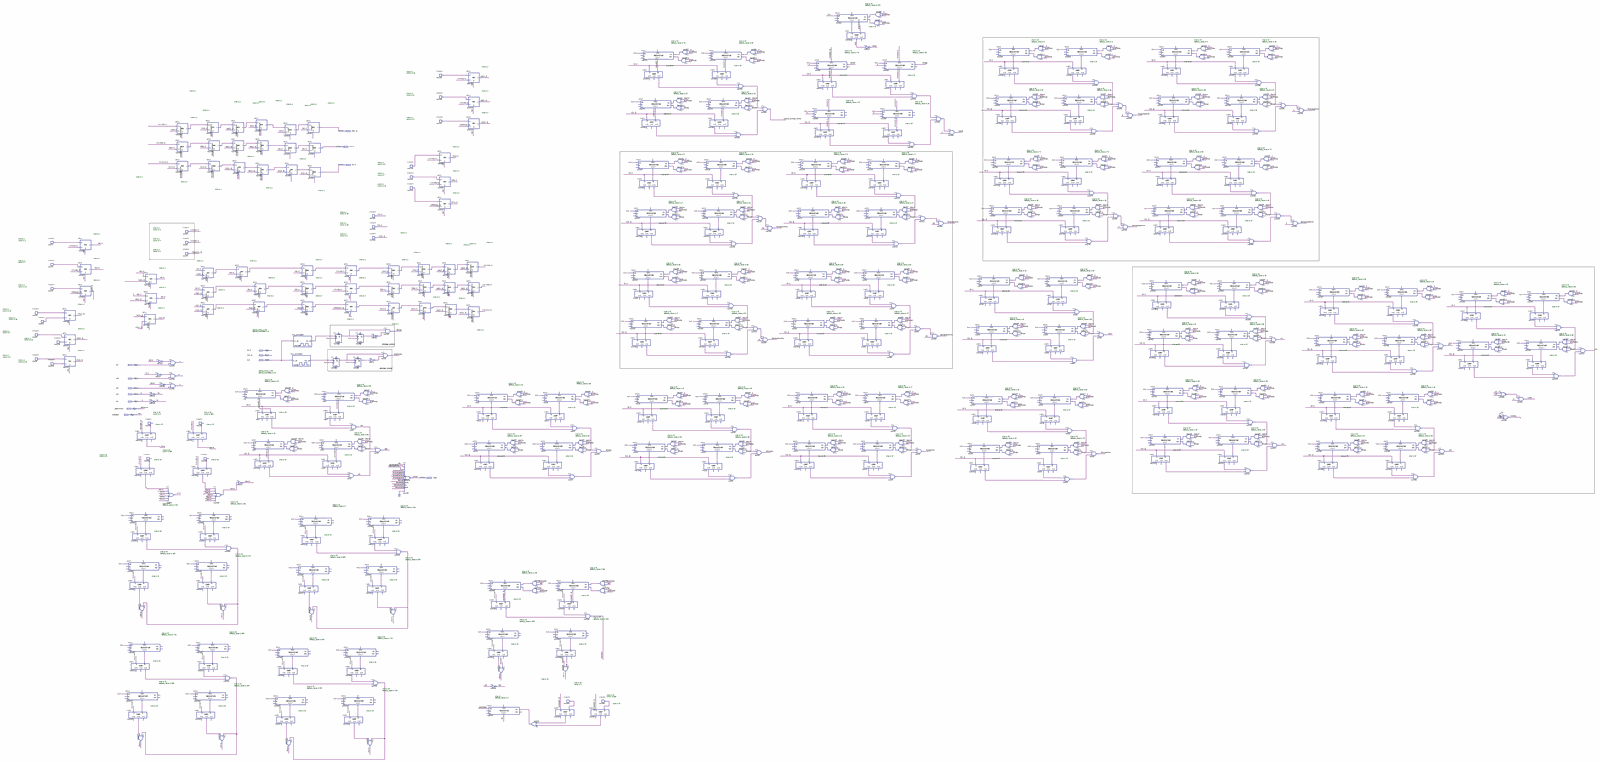
[diagram p0: schematic sheet, whole]
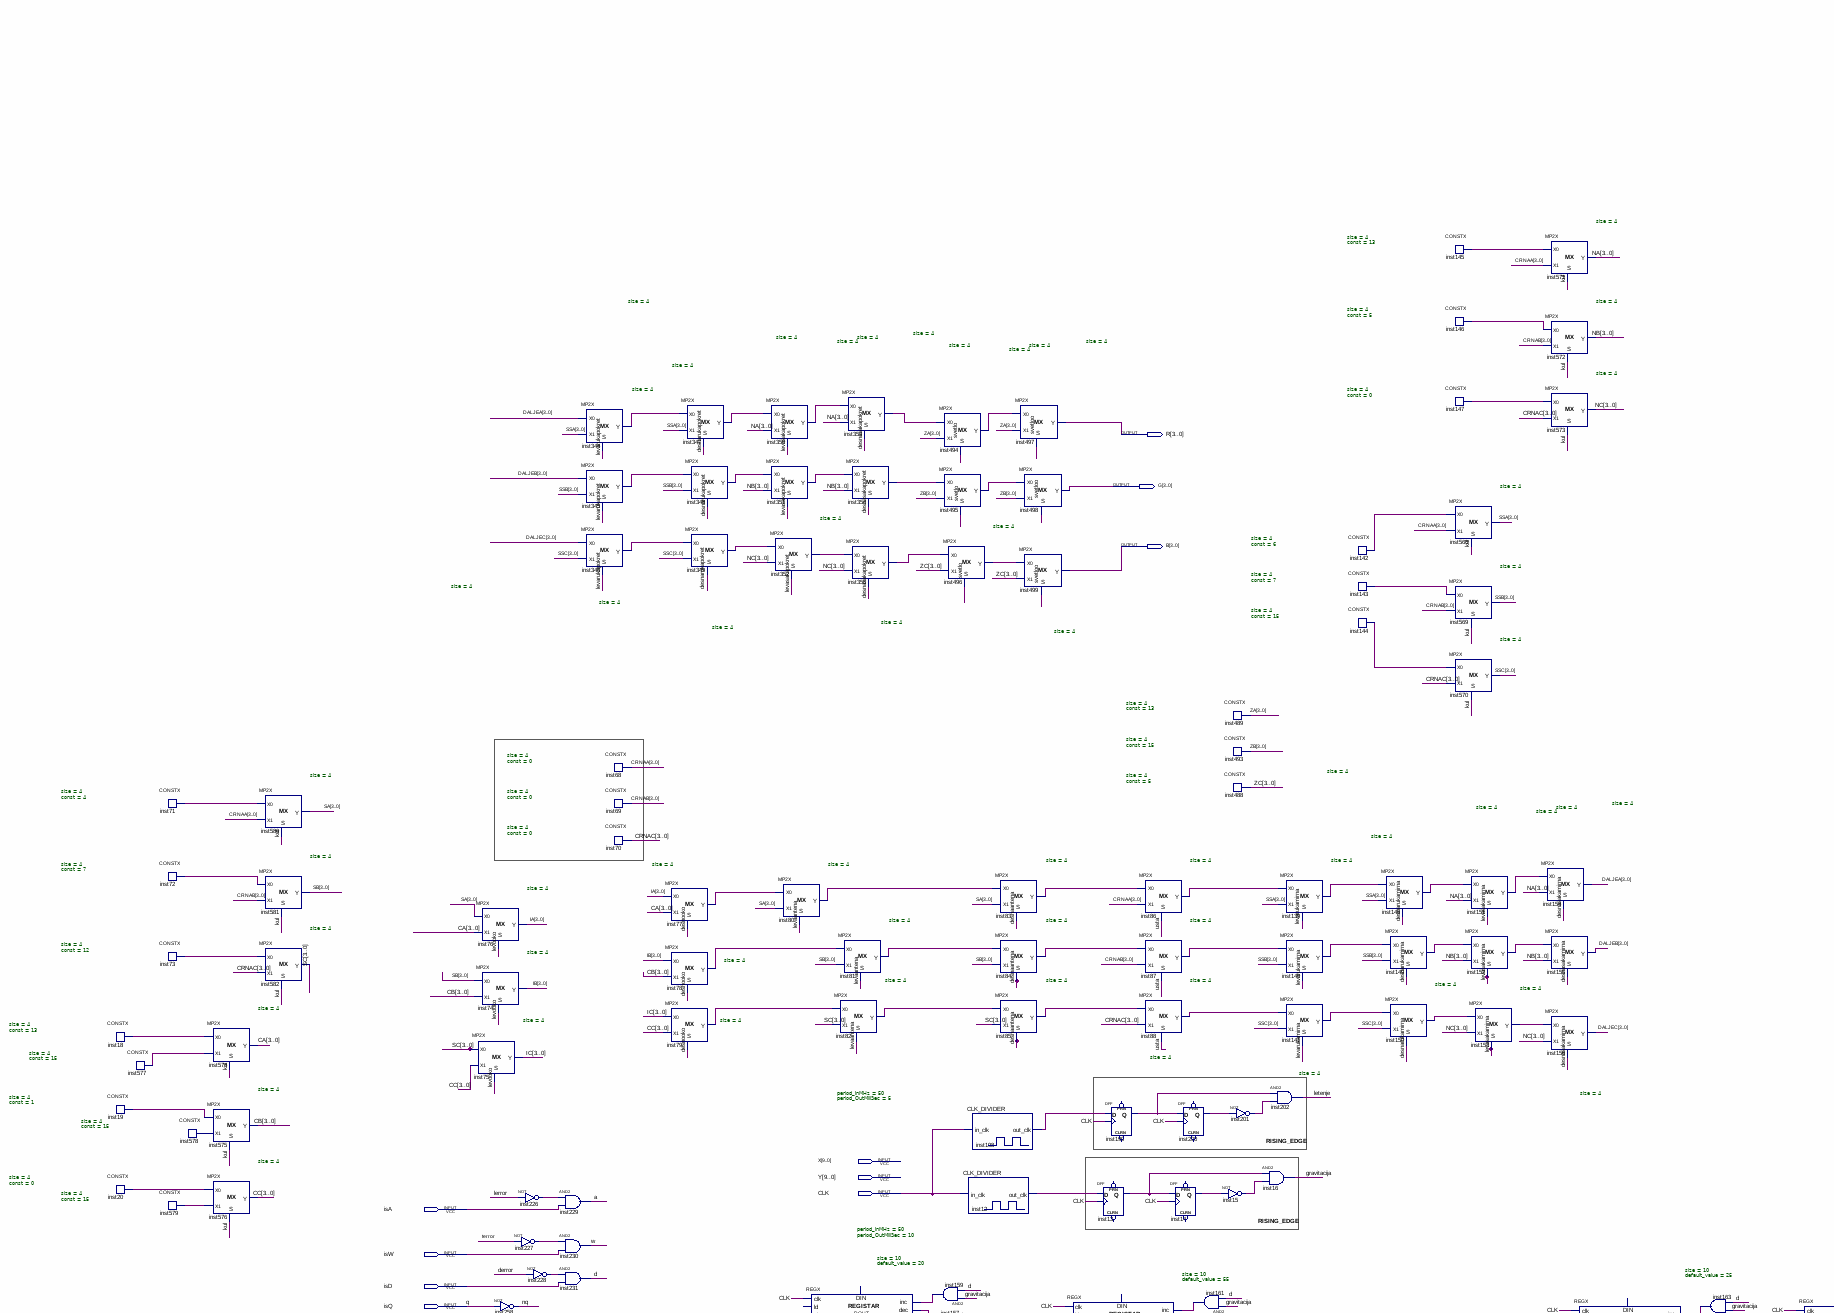
[diagram p1: schematic sheet, upper left part]
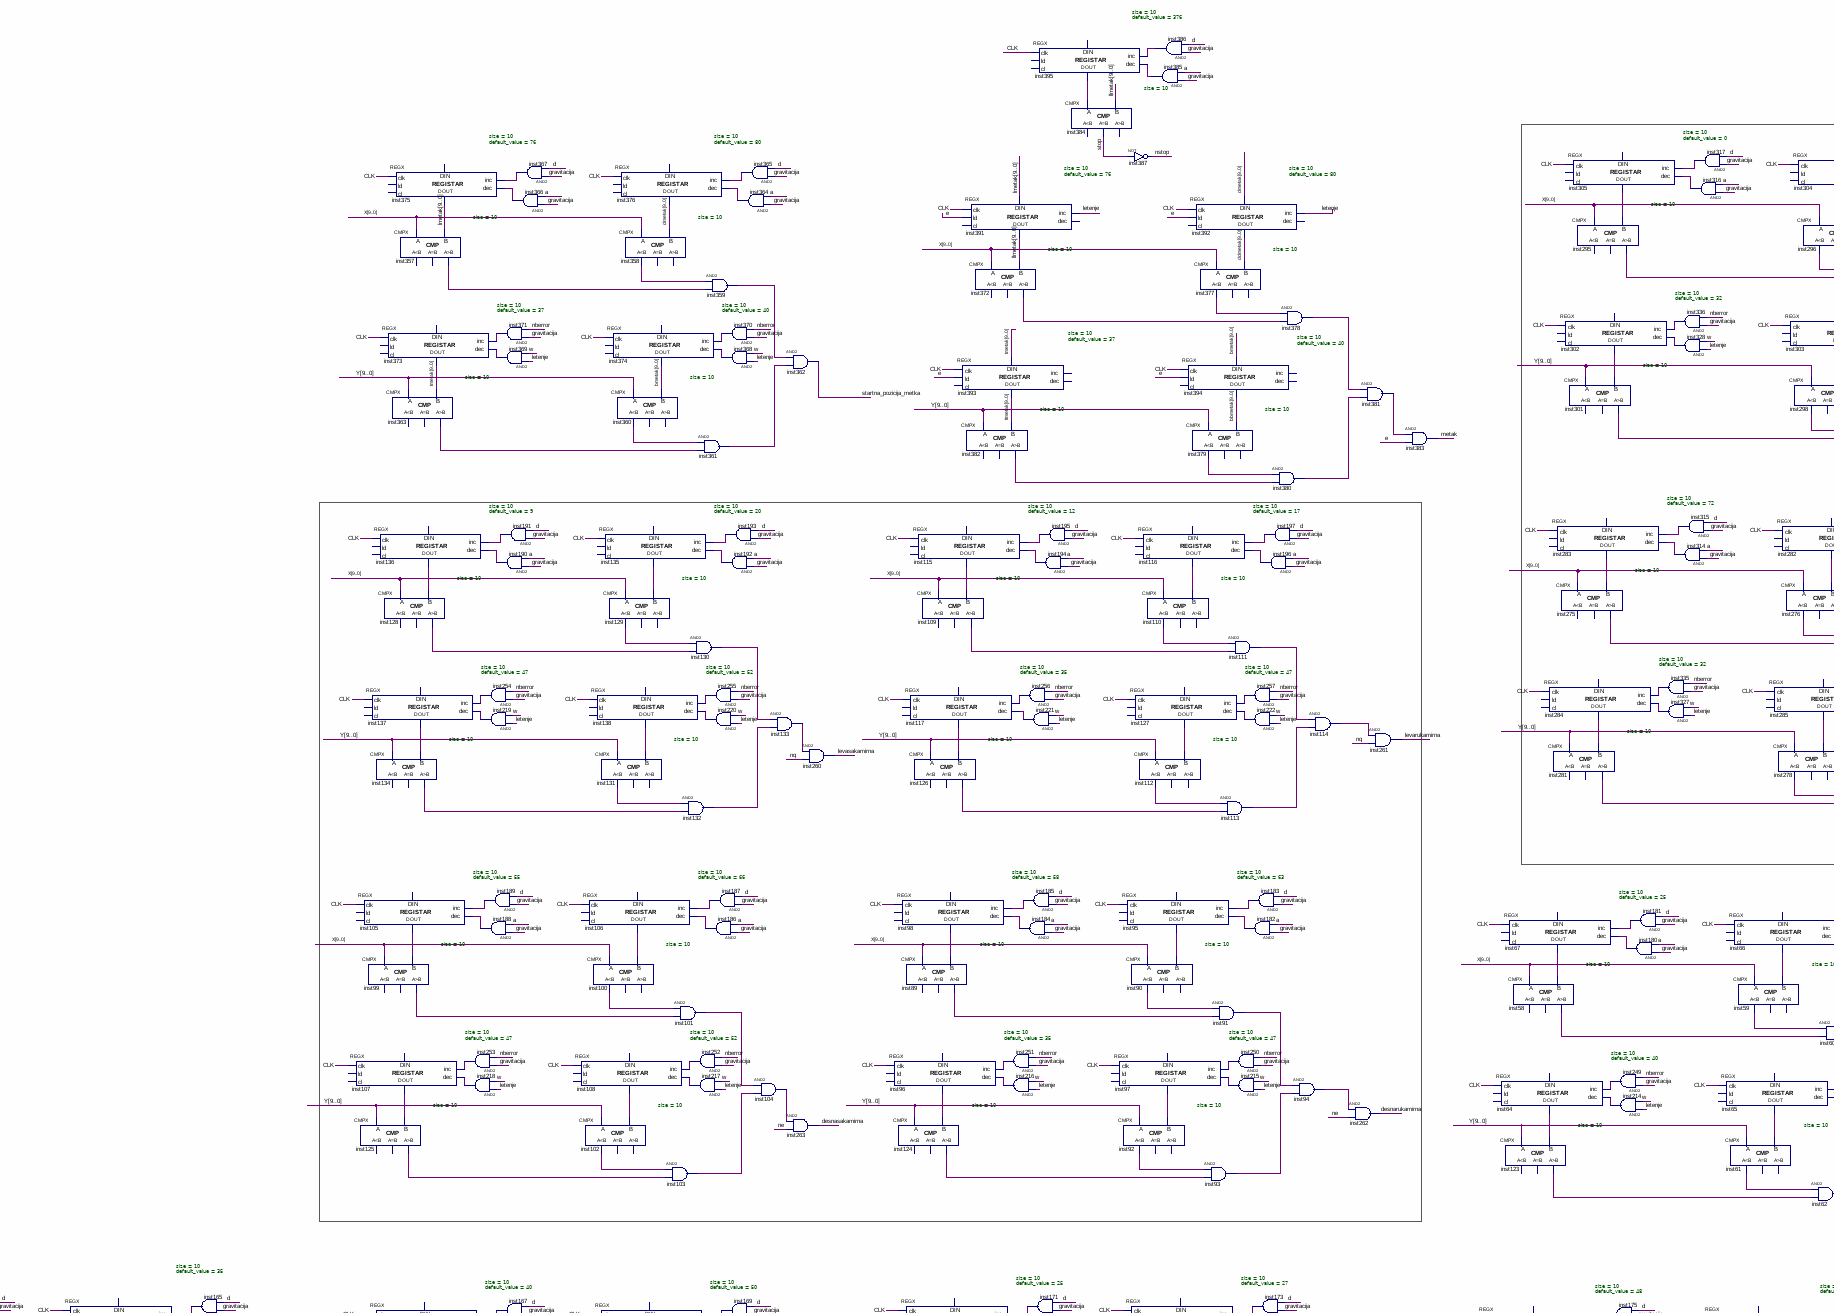
[diagram p2: schematic sheet, upper centre part]
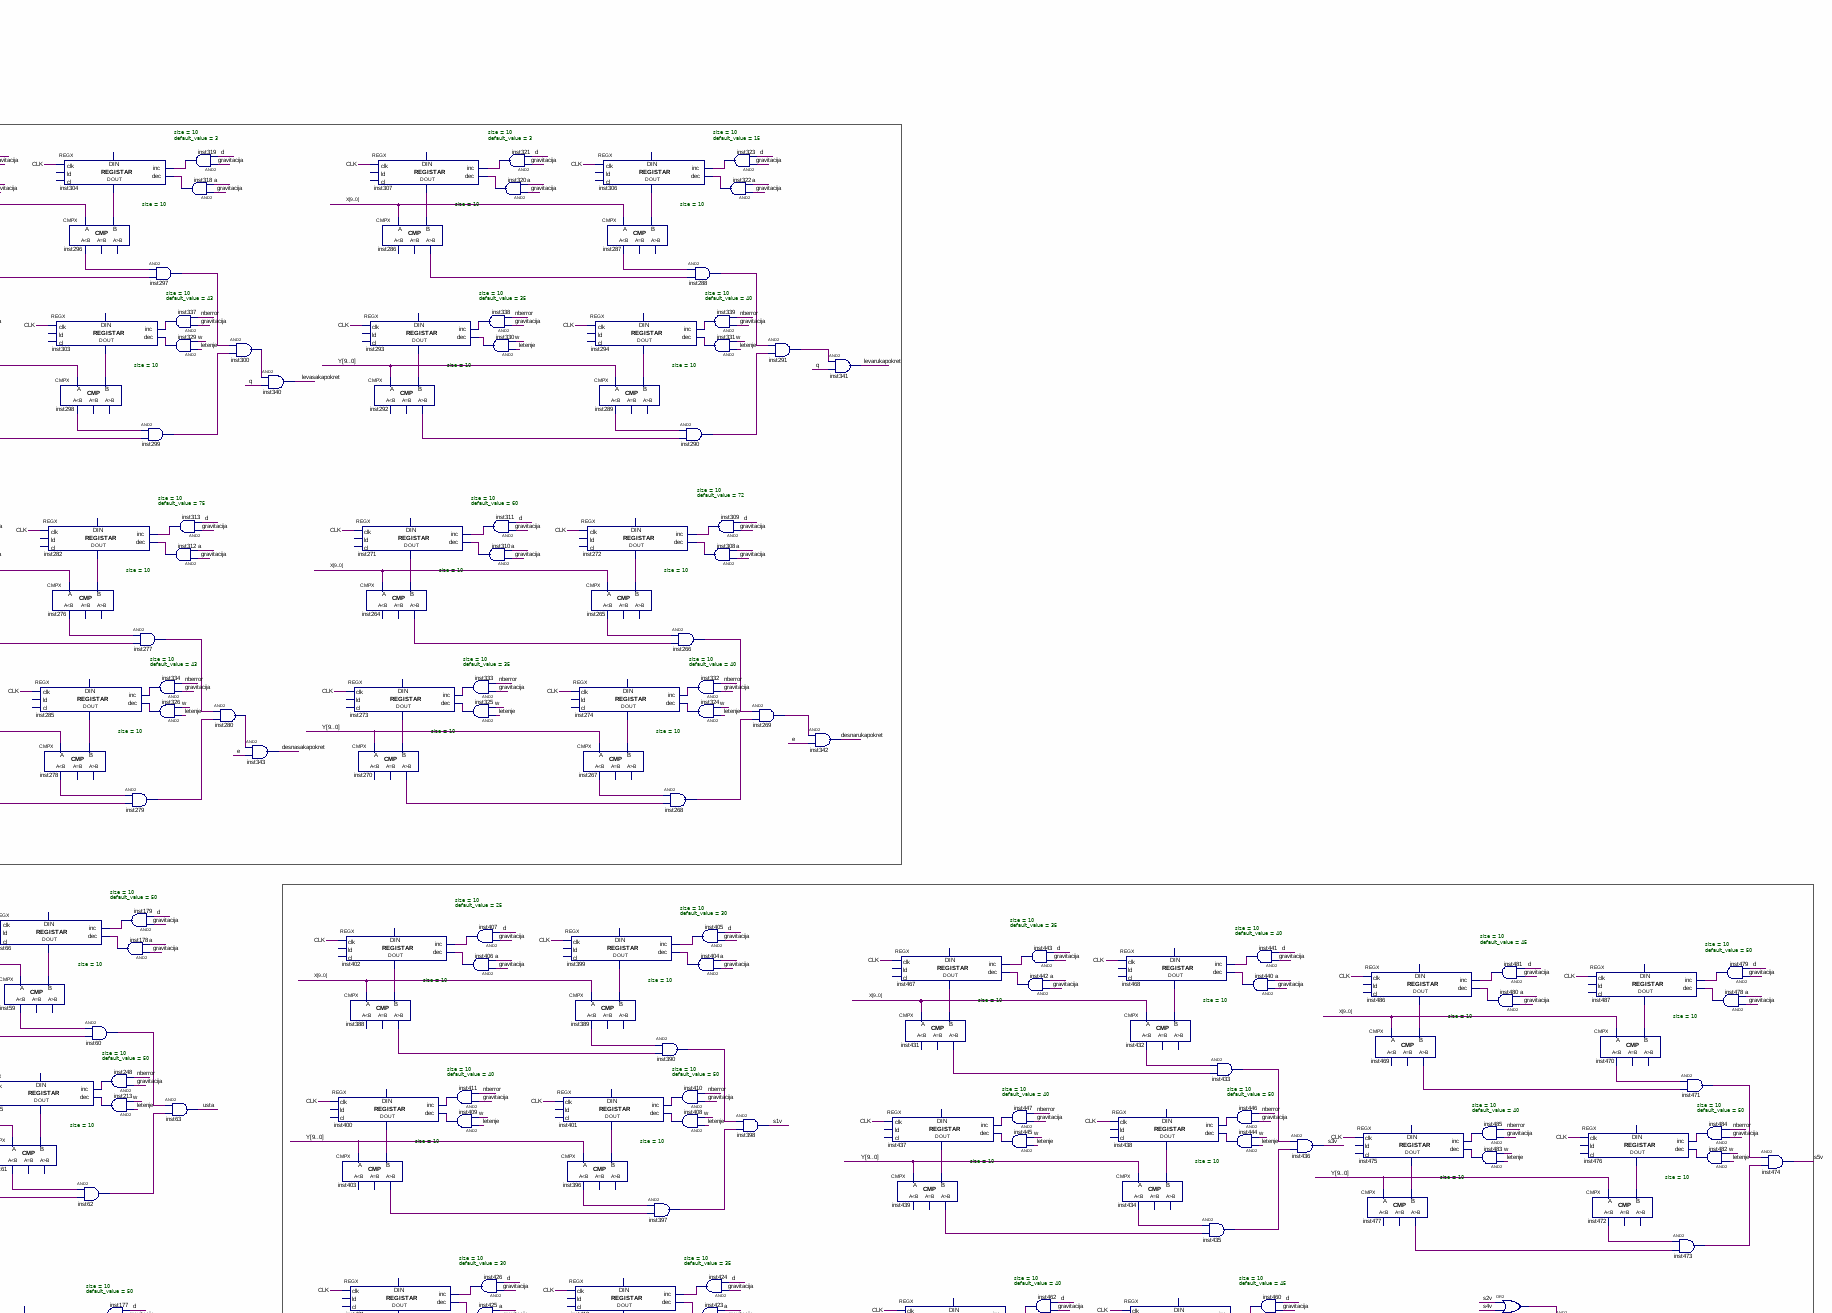
[diagram p3: schematic sheet, upper right part]
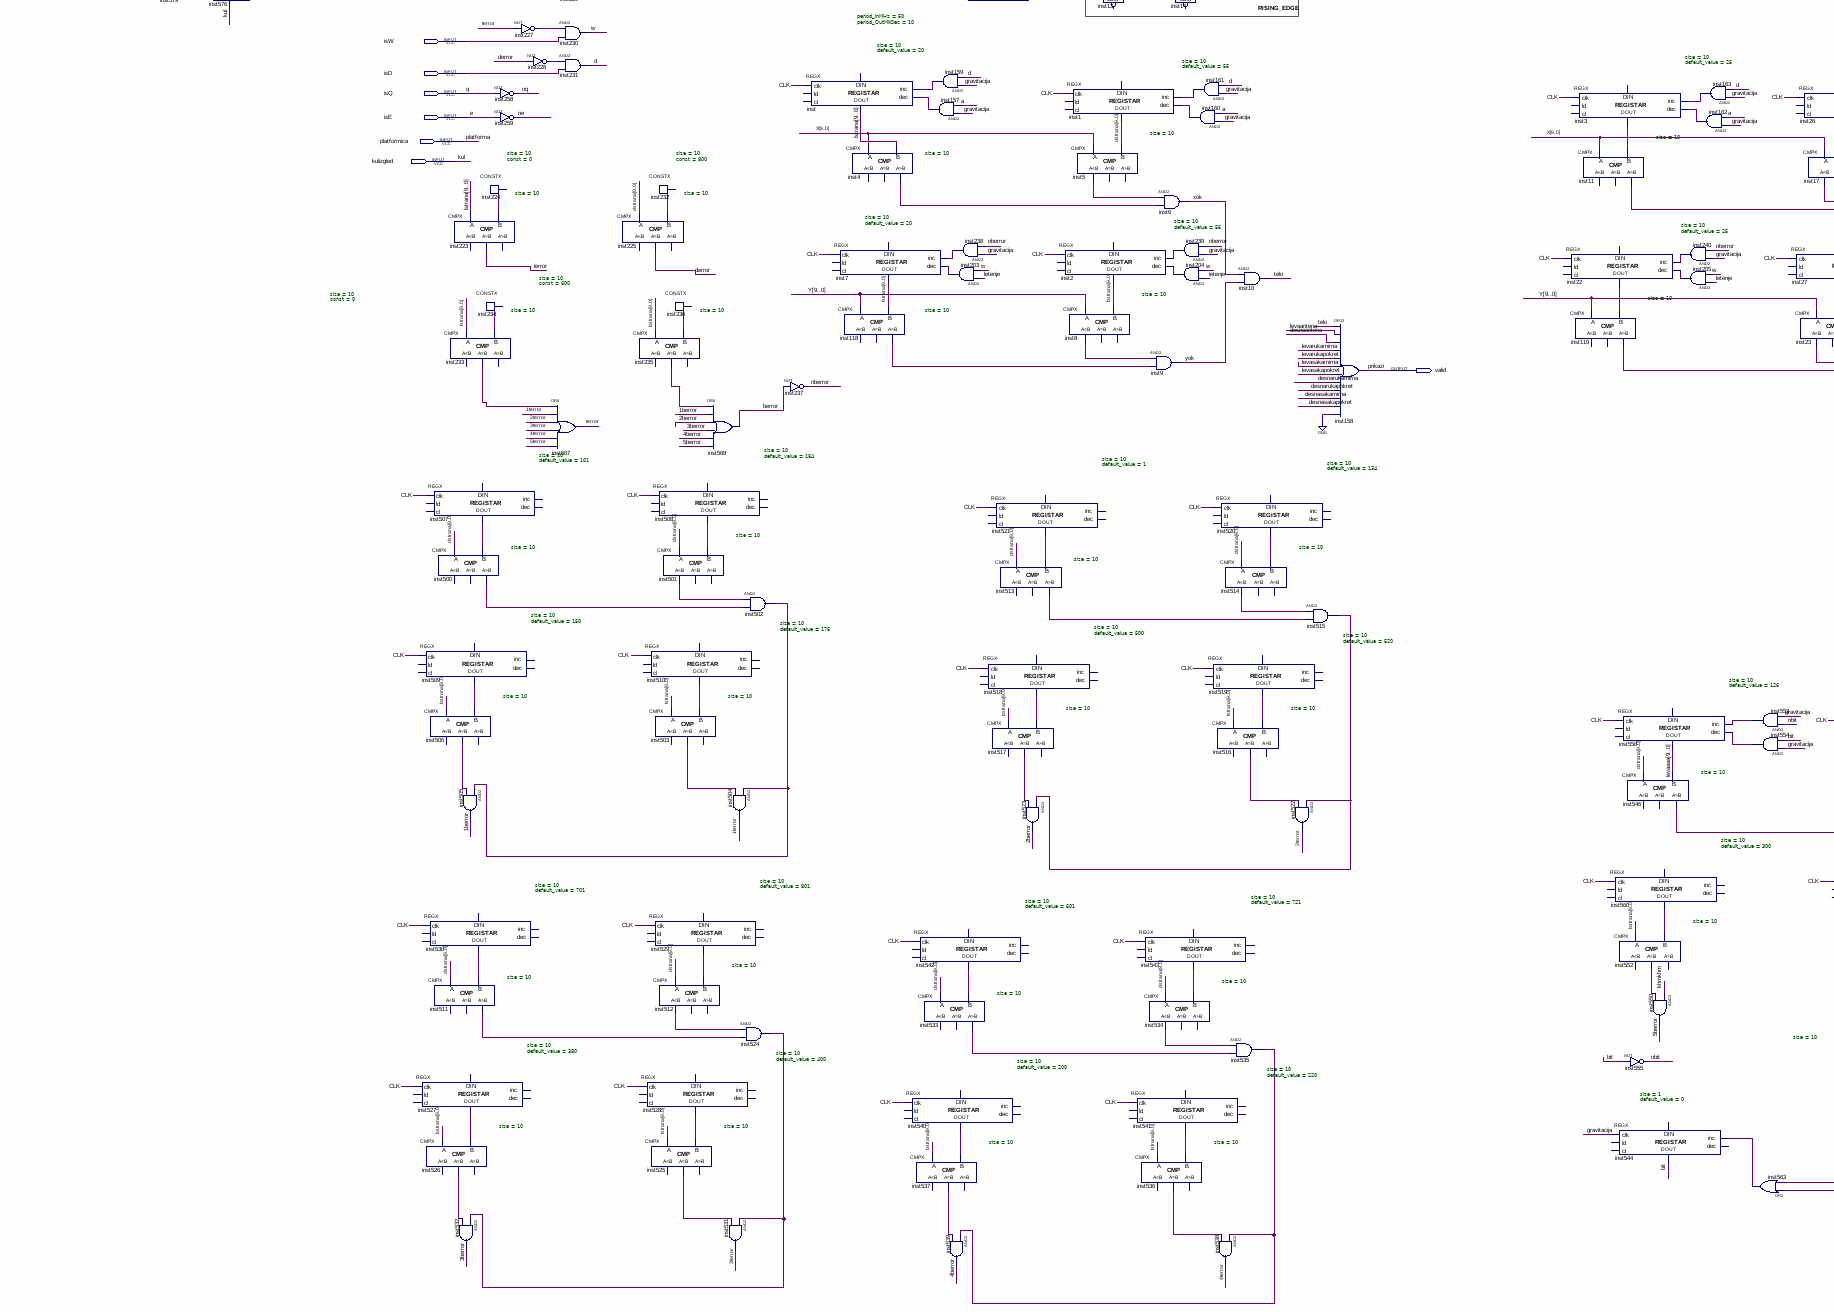
[diagram p4: schematic sheet, lower left part]
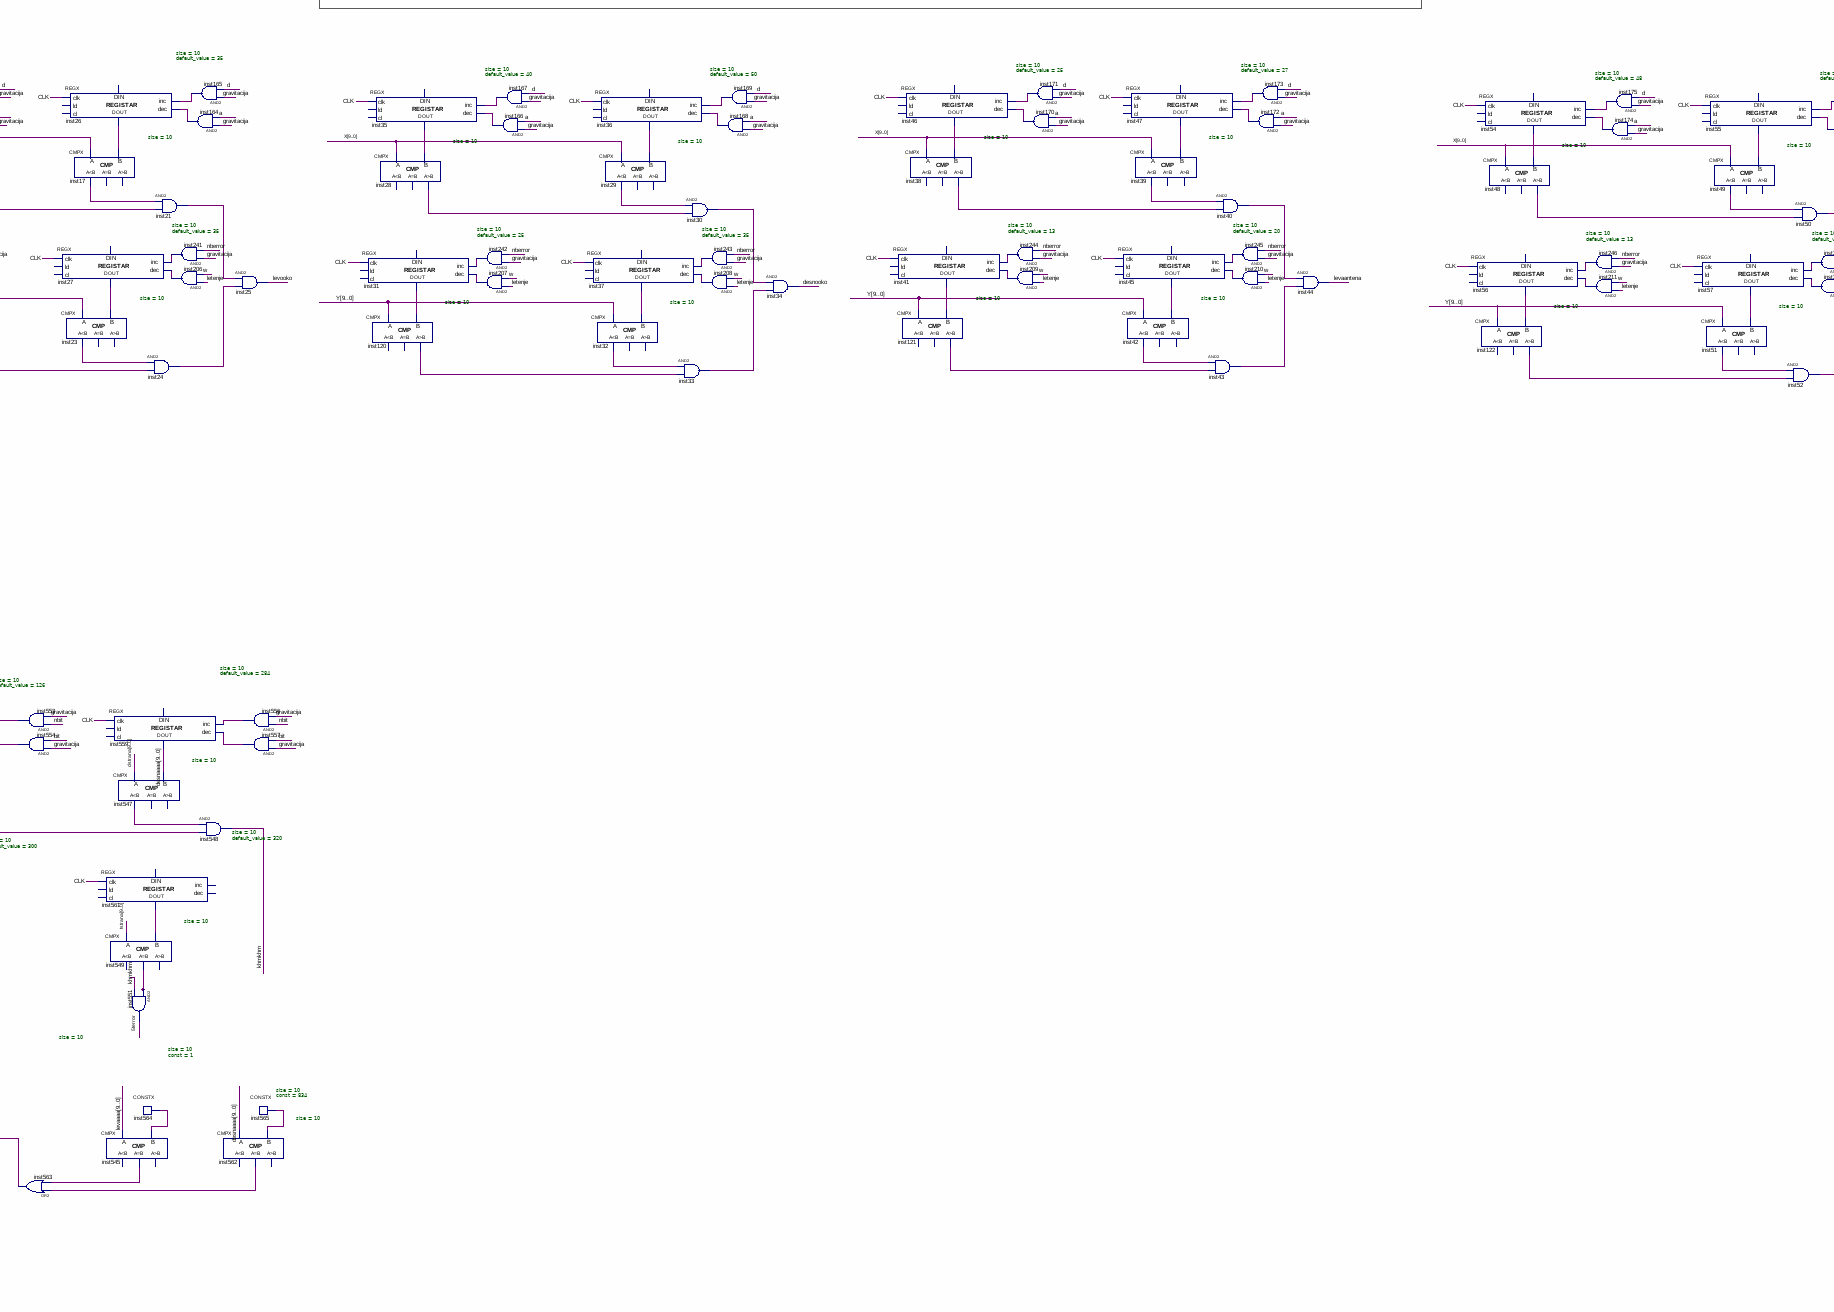
[diagram p5: schematic sheet, lower centre part]
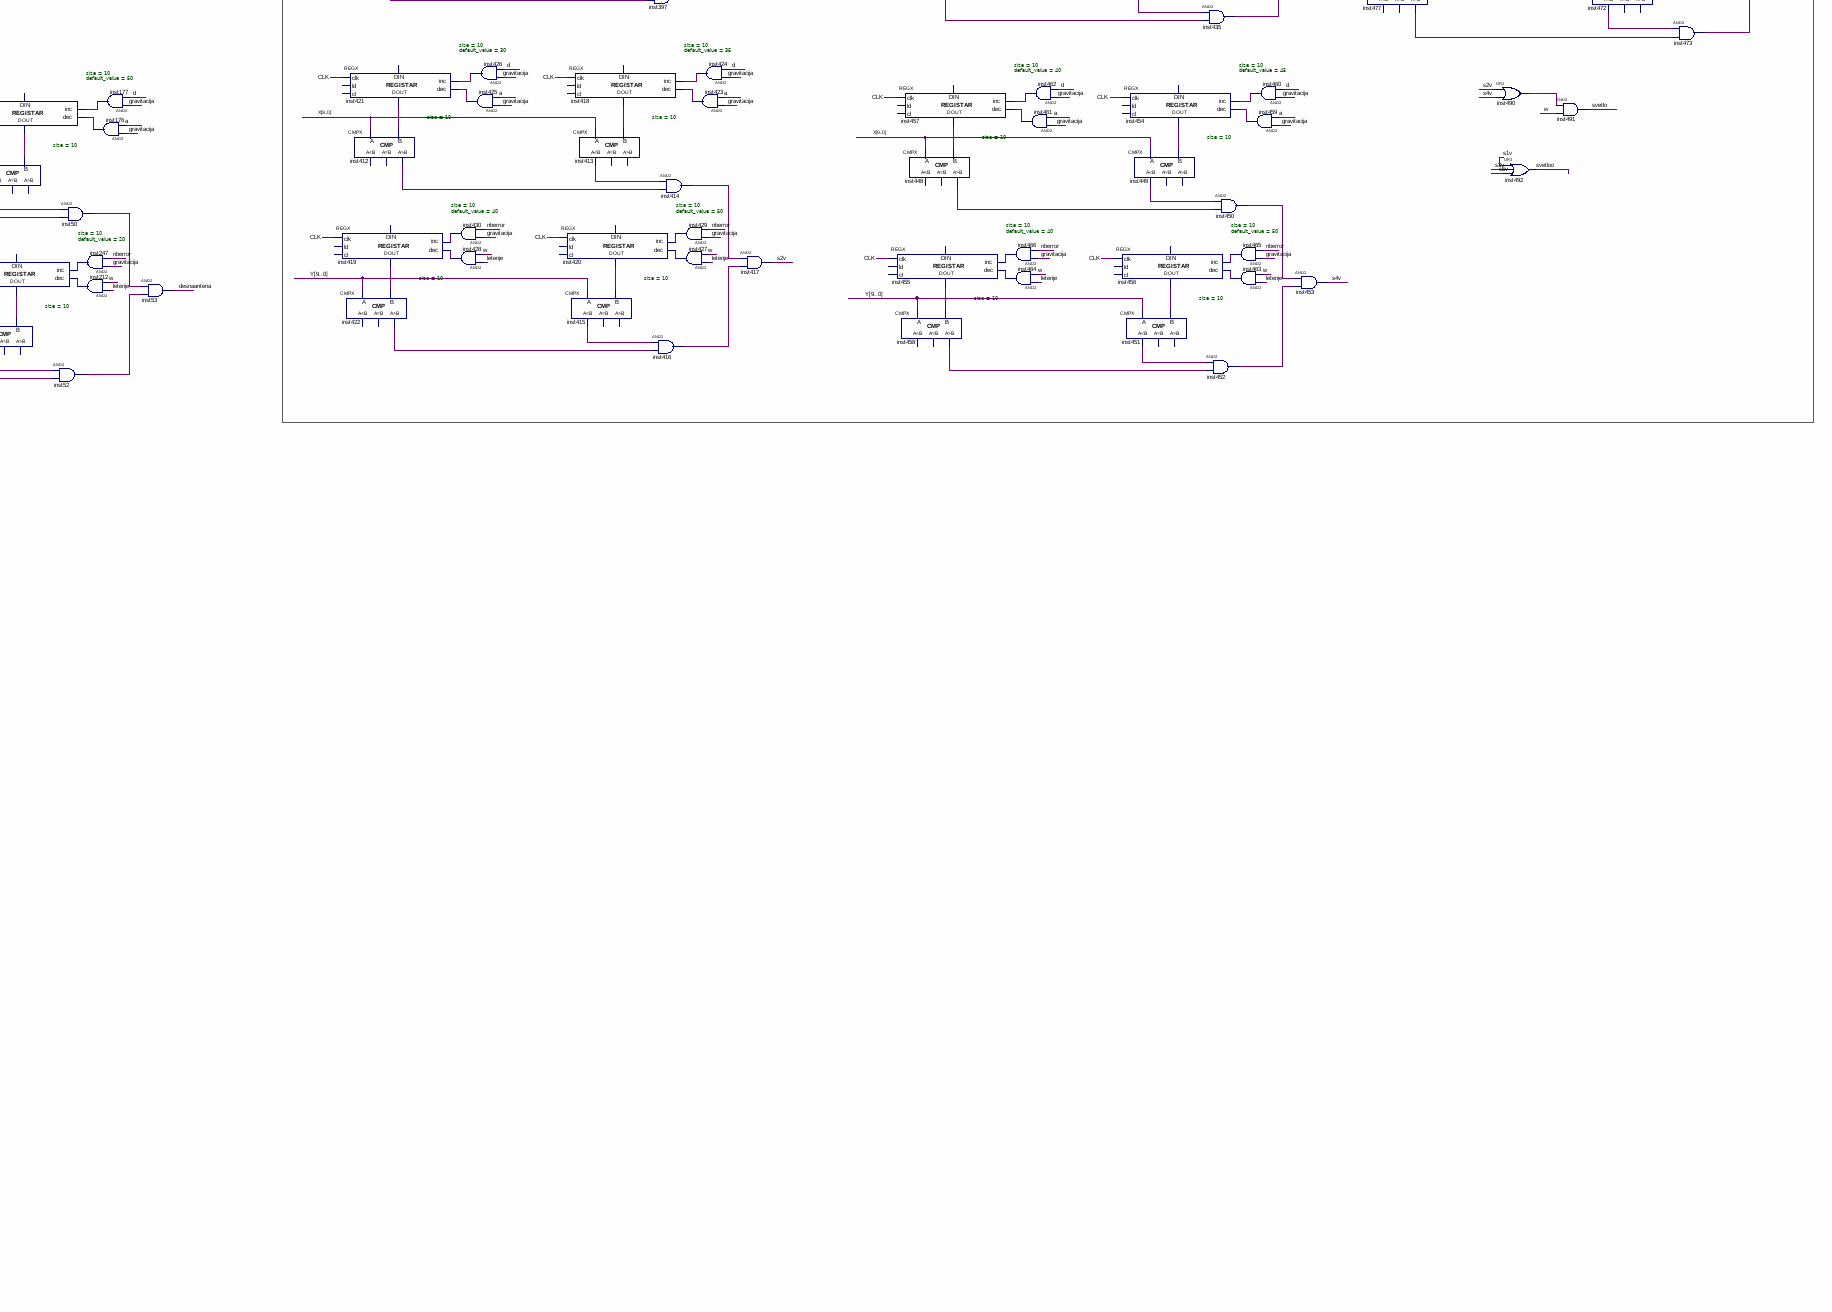
[diagram p6: schematic sheet, lower right part]
// Quartus schematic Robot.bdf as structural Verilog: 582 symbols, 14 pins
module Robot (
  input  [9:0] X,
  input  [9:0] Y,
  input  CLK,
  input  isA,
  input  isW,
  input  isD,
  input  isQ,
  input  isE,
  input  platformica,
  input  kulizgled,
  output [3:0] R,
  output [3:0] G,
  output [3:0] B,
  output valid
);

  wire \1berror , \1terror , \2berror , \2terror , \3berror , \3terror , \4berror , \4terror , \5berror ,
       \5terror , a, berror, \bit , d, derror, desnaantena, desnarukamirna, desnarukapokret, desnasakamirna,
       desnasakapokret, desnooko, gravitacija, inst4_gr, inst5_ls, inst8_ls, inst11_gr, inst12_out_clk,
       inst13_q, inst14_q, inst15_out, inst17_ls, inst21_out, inst23_ls, inst24_out, inst28_gr, inst29_ls,
       inst30_out, inst32_ls, inst33_out, inst38_gr, inst39_ls, inst40_out, inst42_ls, inst43_out, inst48_gr,
       inst49_ls, inst50_out, inst51_ls, inst52_out, inst58_gr, inst59_ls, inst60_out, inst61_ls, inst62_out,
       inst89_gr, inst90_ls, inst91_out, inst92_ls, inst93_out, inst94_out, inst99_gr, inst100_ls,
       inst101_out, inst102_ls, inst103_out, inst104_out, inst109_gr, inst110_ls, inst111_out, inst112_ls,
       inst113_out, inst114_out, inst118_gr, inst119_gr, inst120_gr, inst121_gr, inst122_gr, inst123_gr,
       inst124_gr, inst125_gr, inst126_gr, inst128_gr, inst129_ls, inst130_out, inst131_ls, inst132_out,
       inst133_out, inst134_gr, inst157_out, inst159_out, inst160_out, inst161_out, inst162_out, inst163_out,
       inst164_out, inst165_out, inst166_out, inst167_out, inst168_out, inst169_out, inst170_out,
       inst171_out, inst172_out, inst173_out, inst174_out, inst175_out, inst176_out, inst177_out,
       inst178_out, inst179_out, inst180_out, inst181_out, inst182_out, inst183_out, inst184_out,
       inst185_out, inst186_out, inst187_out, inst188_out, inst189_out, inst190_out, inst191_out,
       inst192_out, inst193_out, inst194_out, inst195_out, inst196_out, inst197_out, inst198_out_clk,
       inst199_q, inst200_q, inst201_out, inst203_out, inst204_out, inst205_out, inst206_out, inst207_out,
       inst208_out, inst209_out, inst210_out, inst211_out, inst212_out, inst213_out, inst214_out,
       inst215_out, inst216_out, inst217_out, inst218_out, inst219_out, inst220_out, inst221_out,
       inst222_out, inst226_out, inst227_out, inst228_out, inst233_eq, inst235_eq, inst238_out, inst239_out,
       inst240_out, inst241_out, inst242_out, inst243_out, inst244_out, inst245_out, inst246_out,
       inst247_out, inst248_out, inst249_out, inst250_out, inst251_out, inst252_out, inst253_out,
       inst254_out, inst255_out, inst256_out, inst257_out, inst264_gr, inst265_ls, inst266_out, inst267_ls,
       inst268_out, inst269_out, inst270_gr, inst275_gr, inst276_ls, inst277_out, inst278_ls, inst279_out,
       inst280_out, inst281_gr, inst286_gr, inst287_ls, inst288_out, inst289_ls, inst290_out, inst291_out,
       inst292_gr, inst295_gr, inst296_ls, inst297_out, inst298_ls, inst299_out, inst300_out, inst301_gr,
       inst308_out, inst309_out, inst310_out, inst311_out, inst312_out, inst313_out, inst314_out,
       inst315_out, inst316_out, inst317_out, inst318_out, inst319_out, inst320_out, inst321_out,
       inst322_out, inst323_out, inst324_out, inst325_out, inst326_out, inst327_out, inst328_out,
       inst329_out, inst330_out, inst331_out, inst332_out, inst333_out, inst334_out, inst335_out,
       inst336_out, inst337_out, inst338_out, inst339_out, inst357_gr, inst358_ls, inst359_out, inst360_ls,
       inst361_out, inst363_gr, inst364_out, inst365_out, inst366_out, inst367_out, inst368_out, inst369_out,
       inst370_out, inst371_out, inst372_gr, inst377_ls, inst378_out, inst379_ls, inst380_out, inst381_out,
       inst382_gr, inst385_out, inst386_out, inst388_gr, inst389_ls, inst390_out, inst396_ls, inst397_out,
       inst403_gr, inst404_out, inst405_out, inst406_out, inst407_out, inst408_out, inst409_out, inst410_out,
       inst411_out, inst412_gr, inst413_ls, inst414_out, inst415_ls, inst416_out, inst422_gr, inst423_out,
       inst424_out, inst425_out, inst426_out, inst427_out, inst428_out, inst429_out, inst430_out, inst431_gr,
       inst432_ls, inst433_out, inst434_ls, inst435_out, inst439_gr, inst440_out, inst441_out, inst442_out,
       inst443_out, inst444_out, inst445_out, inst446_out, inst447_out, inst448_gr, inst449_ls, inst450_out,
       inst451_ls, inst452_out, inst458_gr, inst459_out, inst460_out, inst461_out, inst462_out, inst463_out,
       inst464_out, inst465_out, inst466_out, inst469_gr, inst470_ls, inst471_out, inst472_ls, inst473_out,
       inst477_gr, inst478_out, inst479_out, inst480_out, inst481_out, inst482_out, inst483_out, inst484_out,
       inst485_out, inst490_out, inst500_gr, inst501_ls, inst502_out, inst503_eq, inst506_eq, inst511_gr,
       inst512_ls, inst513_gr, inst514_ls, inst515_out, inst516_eq, inst517_eq, inst524_out, inst525_eq,
       inst526_eq, inst533_gr, inst534_ls, inst535_out, inst536_eq, inst537_eq, inst545_eq, inst546_gr,
       inst547_ls, inst549_eq, inst552_eq, inst553_out, inst554_out, inst556_out, inst557_out, inst562_eq,
       inst563_out, khmkhm, lerror, letenje, levaantena, levarukamirna, levarukapokret, levasakamirna,
       levasakapokret, levooko, metak, nberror, nbit, ne, nq, nstop, s1v, s2v, s3v, s4v, s5v,
       startna_pozicija_metka, stop, svetlo, svetloo, telo, terror, usta, w, xok, yok;
  wire [3:0] CA, CB, CC, CRNAA, CRNAB, CRNAC, DALJEA, DALJEB, DALJEC, IA, IB, IC, inst18_data, inst19_data,
       inst20_data, inst71_data, inst72_data, inst73_data, inst77_y, inst78_y, inst79_y, inst80_y, inst81_y,
       inst82_y, inst83_y, inst84_y, inst85_y, inst86_y, inst87_y, inst88_y, inst139_y, inst140_y, inst141_y,
       inst142_data, inst143_data, inst144_data, inst145_data, inst146_data, inst147_data, inst148_y,
       inst149_y, inst150_y, inst151_y, inst152_y, inst153_y, inst344_y, inst345_y, inst346_y, inst347_y,
       inst348_y, inst349_y, inst350_y, inst351_y, inst352_y, inst353_y, inst354_y, inst355_y, inst494_y,
       inst495_y, inst496_y, inst577_data, inst578_data, inst579_data, NA, NB, NC, SA, SB, SC, SSA, SSB, SSC,
       ZA, ZB, ZC;
  wire [9:0] bbmetak, bmetak, bstrana, ddmetak, desnaaaa, dmetak, dstrana, inst3_data_out, inst22_data_out,
       inst26_data_out, inst27_data_out, inst31_data_out, inst35_data_out, inst36_data_out, inst37_data_out,
       inst41_data_out, inst45_data_out, inst46_data_out, inst47_data_out, inst54_data_out, inst55_data_out,
       inst56_data_out, inst57_data_out, inst64_data_out, inst65_data_out, inst66_data_out, inst67_data_out,
       inst95_data_out, inst96_data_out, inst97_data_out, inst98_data_out, inst105_data_out,
       inst106_data_out, inst107_data_out, inst108_data_out, inst115_data_out, inst116_data_out,
       inst117_data_out, inst127_data_out, inst135_data_out, inst136_data_out, inst137_data_out,
       inst138_data_out, inst224_data, inst232_data, inst234_data, inst236_data, inst271_data_out,
       inst272_data_out, inst273_data_out, inst274_data_out, inst282_data_out, inst283_data_out,
       inst284_data_out, inst285_data_out, inst293_data_out, inst294_data_out, inst302_data_out,
       inst303_data_out, inst304_data_out, inst305_data_out, inst306_data_out, inst307_data_out,
       inst395_data_out, inst399_data_out, inst400_data_out, inst401_data_out, inst402_data_out,
       inst418_data_out, inst419_data_out, inst420_data_out, inst421_data_out, inst437_data_out,
       inst438_data_out, inst454_data_out, inst455_data_out, inst456_data_out, inst457_data_out,
       inst467_data_out, inst468_data_out, inst475_data_out, inst476_data_out, inst486_data_out,
       inst487_data_out, inst507_data_out, inst508_data_out, inst509_data_out, inst510_data_out,
       inst518_data_out, inst519_data_out, inst520_data_out, inst521_data_out, inst527_data_out,
       inst528_data_out, inst529_data_out, inst530_data_out, inst540_data_out, inst541_data_out,
       inst542_data_out, inst543_data_out, inst560_data_out, inst561_data_out, inst564_data, inst565_data,
       levaaaa, llmetak, lmetak, lstrana, tmetak, tstrana, ttmetak;

  CONSTX #(.size(4), .\const (13)) inst18 (.data(inst18_data));
  CONSTX #(.size(4), .\const (1)) inst19 (.data(inst19_data));
  CONSTX #(.size(4), .\const (0)) inst20 (.data(inst20_data));
  CONSTX #(.size(4), .\const (15)) inst577 (.data(inst577_data));
  CONSTX #(.size(4), .\const (4)) inst71 (.data(inst71_data));
  CONSTX #(.size(4), .\const (7)) inst72 (.data(inst72_data));
  CONSTX #(.size(4), .\const (12)) inst73 (.data(inst73_data));
  CONSTX #(.size(4), .\const (15)) inst578 (.data(inst578_data));
  CONSTX #(.size(4), .\const (15)) inst579 (.data(inst579_data));
  MP2X #(.size(4)) inst574 (.S(kulizgled), .X0(inst18_data), .X1(inst577_data), .Y(CA));
  MP2X #(.size(4)) inst575 (.S(kulizgled), .X0(inst19_data), .X1(inst578_data), .Y(CB));
  MP2X #(.size(4)) inst576 (.S(kulizgled), .X0(inst20_data), .X1(inst579_data), .Y(CC));
  MP2X #(.size(4)) inst580 (.S(kulizgled), .X0(inst71_data), .X1(CRNAA), .Y(SA));
  MP2X #(.size(4)) inst581 (.S(kulizgled), .X0(inst72_data), .X1(CRNAB), .Y(SB));
  MP2X #(.size(4)) inst582 (.S(kulizgled), .X0(inst73_data), .X1(CRNAC), .Y(SC));
  CMPX #(.size(10)) inst233 (.A(tstrana), .B(inst234_data), .eq(inst233_eq));  // open: ls, gr
  REGX #(.size(10), .default_value(101)) inst507 (
    .clk(CLK), .data_out(inst507_data_out));  // open: ld, cl, inc, dec, data_in
  CMPX #(.size(10)) inst500 (.A(dstrana), .B(inst507_data_out), .gr(inst500_gr));  // open: ls, eq
  REGX #(.size(10), .default_value(150)) inst509 (
    .clk(CLK), .data_out(inst509_data_out));  // open: ld, cl, inc, dec, data_in
  CMPX #(.size(10)) inst506 (.A(bstrana), .B(inst509_data_out), .eq(inst506_eq));  // open: ls, gr
  REGX #(.size(10), .default_value(701)) inst530 (
    .clk(CLK), .data_out(inst530_data_out));  // open: ld, cl, inc, dec, data_in
  CMPX #(.size(10)) inst511 (.A(dstrana), .B(inst530_data_out), .gr(inst511_gr));  // open: ls, eq
  REGX #(.size(10), .default_value(380)) inst527 (
    .clk(CLK), .data_out(inst527_data_out));  // open: ld, cl, inc, dec, data_in
  CMPX #(.size(10)) inst526 (.A(bstrana), .B(inst527_data_out), .eq(inst526_eq));  // open: ls, gr
  MP2X #(.size(4)) inst76 (.S(levooko), .X0(SA), .X1(CA), .Y(IA));
  MP2X #(.size(4)) inst74 (.S(levooko), .X0(SB), .X1(CB), .Y(IB));
  MP2X #(.size(4)) inst75 (.S(levooko), .X0(SC), .X1(CC), .Y(IC));
  CMPX #(.size(10)) inst223 (.A(lstrana), .B(inst224_data), .eq(lerror));  // open: ls, gr
  CONSTX #(.size(10), .\const (0)) inst234 (.data(inst234_data));
  and inst505 (\1berror , inst502_out, inst506_eq);
  and inst532 (\3berror , inst524_out, inst526_eq);
  not inst258 (nq, isQ);
  not inst259 (ne, isE);
  CONSTX #(.size(10), .\const (0)) inst224 (.data(inst224_data));
  not inst226 (inst226_out, lerror);
  not inst227 (inst227_out, terror);
  not inst228 (inst228_out, derror);
  and inst229 (a, inst226_out, isA);
  and inst230 (w, inst227_out, isW);
  and inst231 (d, inst228_out, isD);
  or inst567 (terror, inst233_eq, \1terror , \2terror , \3terror , \4terror , \5terror );
  MP2X #(.size(4)) inst344 (.S(levarukapokret), .X0(DALJEA), .X1(SSA), .Y(inst344_y));
  MP2X #(.size(4)) inst345 (.S(levarukapokret), .X0(DALJEB), .X1(SSB), .Y(inst345_y));
  MP2X #(.size(4)) inst346 (.S(levarukapokret), .X0(DALJEC), .X1(SSC), .Y(inst346_y));
  CONSTX #(.size(4), .\const (0)) inst68 (.data(CRNAA));
  CONSTX #(.size(4), .\const (0)) inst69 (.data(CRNAB));
  CONSTX #(.size(4), .\const (0)) inst70 (.data(CRNAC));
  CMPX #(.size(10)) inst225 (.A(dstrana), .B(inst232_data), .eq(derror));  // open: ls, gr
  CMPX #(.size(10)) inst235 (.A(bstrana), .B(inst236_data), .eq(inst235_eq));  // open: ls, gr
  MP2X #(.size(4)) inst77 (.S(desnooko), .X0(IA), .X1(CA), .Y(inst77_y));
  MP2X #(.size(4)) inst78 (.S(desnooko), .X0(IB), .X1(CB), .Y(inst78_y));
  MP2X #(.size(4)) inst79 (.S(desnooko), .X0(IC), .X1(CC), .Y(inst79_y));
  CONSTX #(.size(10), .\const (800)) inst232 (.data(inst232_data));
  CONSTX #(.size(10), .\const (600)) inst236 (.data(inst236_data));
  REGX #(.size(10), .default_value(184)) inst508 (
    .clk(CLK), .data_out(inst508_data_out));  // open: ld, cl, inc, dec, data_in
  CMPX #(.size(10)) inst501 (.A(dstrana), .B(inst508_data_out), .ls(inst501_ls));  // open: eq, gr
  REGX #(.size(10), .default_value(175)) inst510 (
    .clk(CLK), .data_out(inst510_data_out));  // open: ld, cl, inc, dec, data_in
  CMPX #(.size(10)) inst503 (.A(tstrana), .B(inst510_data_out), .eq(inst503_eq));  // open: ls, gr
  REGX #(.size(10), .default_value(801)) inst529 (
    .clk(CLK), .data_out(inst529_data_out));  // open: ld, cl, inc, dec, data_in
  CMPX #(.size(10)) inst512 (.A(dstrana), .B(inst529_data_out), .ls(inst512_ls));  // open: eq, gr
  REGX #(.size(10), .default_value(400)) inst528 (
    .clk(CLK), .data_out(inst528_data_out));  // open: ld, cl, inc, dec, data_in
  CMPX #(.size(10)) inst525 (.A(tstrana), .B(inst528_data_out), .eq(inst525_eq));  // open: ls, gr
  MP2X #(.size(4)) inst347 (.S(desnarukapokret), .X0(inst344_y), .X1(SSA), .Y(inst347_y));
  MP2X #(.size(4)) inst348 (.S(desnarukapokret), .X0(inst345_y), .X1(SSB), .Y(inst348_y));
  MP2X #(.size(4)) inst349 (.S(desnarukapokret), .X0(inst346_y), .X1(SSC), .Y(inst349_y));
  or inst568 (berror, inst235_eq, \1berror , \2berror , \3berror , \4berror , \5berror );
  and inst504 (\1terror , inst502_out, inst503_eq);
  and inst531 (\3terror , inst524_out, inst525_eq);
  MP2X #(.size(4)) inst350 (.S(levasakapokret), .X0(inst347_y), .X1(NA), .Y(inst350_y));
  MP2X #(.size(4)) inst351 (.S(levasakapokret), .X0(inst348_y), .X1(NB), .Y(inst351_y));
  and inst502 (inst502_out, inst501_ls, inst500_gr);
  and inst524 (inst524_out, inst512_ls, inst511_gr);
  MP2X #(.size(4)) inst352 (.S(levasakapokret), .X0(inst349_y), .X1(NC), .Y(inst352_y));
  MP2X #(.size(4)) inst80 (.S(levaantena), .X0(inst77_y), .X1(SA), .Y(inst80_y));
  not inst237 (nberror, berror);
  REGX #(.size(10), .default_value(20)) inst (
    .clk(CLK), .inc(inst159_out), .dec(inst157_out), .data_out(lstrana));  // open: ld, cl, data_in
  MP2X #(.size(4)) inst353 (.S(desnasakapokret), .X0(inst350_y), .X1(NA), .Y(inst353_y));
  MP2X #(.size(4)) inst354 (.S(desnasakapokret), .X0(inst351_y), .X1(NB), .Y(inst354_y));
  MP2X #(.size(4)) inst355 (.S(desnasakapokret), .X0(inst352_y), .X1(NC), .Y(inst355_y));
  MP2X #(.size(4)) inst81 (.S(levaantena), .X0(inst78_y), .X1(SB), .Y(inst81_y));
  MP2X #(.size(4)) inst82 (.S(levaantena), .X0(inst79_y), .X1(SC), .Y(inst82_y));
  CMPX #(.size(10)) inst4 (.A(X), .B(lstrana), .gr(inst4_gr));  // open: ls, eq
  REGX #(.size(10), .default_value(20)) inst7 (
    .clk(CLK), .inc(inst238_out), .dec(inst203_out), .data_out(tstrana));  // open: ld, cl, data_in
  CMPX #(.size(10)) inst118 (.A(Y), .B(tstrana), .gr(inst118_gr));  // open: ls, eq
  REGX #(.size(10), .default_value(501)) inst542 (
    .clk(CLK), .data_out(inst542_data_out));  // open: ld, cl, inc, dec, data_in
  CMPX #(.size(10)) inst533 (.A(dstrana), .B(inst542_data_out), .gr(inst533_gr));  // open: ls, eq
  REGX #(.size(10), .default_value(200)) inst540 (
    .clk(CLK), .data_out(inst540_data_out));  // open: ld, cl, inc, dec, data_in
  CMPX #(.size(10)) inst537 (.A(bstrana), .B(inst540_data_out), .eq(inst537_eq));  // open: ls, gr
  MP2X #(.size(4)) inst494 (.S(svetlo), .X0(inst353_y), .X1(ZA), .Y(inst494_y));
  MP2X #(.size(4)) inst495 (.S(svetlo), .X0(inst354_y), .X1(ZB), .Y(inst495_y));
  MP2X #(.size(4)) inst496 (.S(svetlo), .X0(inst355_y), .X1(ZC), .Y(inst496_y));
  and inst159 (inst159_out, gravitacija, d);
  and inst157 (inst157_out, gravitacija, a);
  and inst238 (inst238_out, gravitacija, nberror);
  and inst203 (inst203_out, letenje, w);
  and inst539 (\4berror , inst535_out, inst537_eq);
  CLK_DIVIDER #(.period_InMHz(50), .period_OutMiliSec(5)) inst198 (.in_clk(CLK), .out_clk(inst198_out_clk));
  CLK_DIVIDER #(.period_InMHz(50), .period_OutMiliSec(10)) inst12 (.in_clk(CLK), .out_clk(inst12_out_clk));
  REGX #(.size(10), .default_value(1)) inst521 (
    .clk(CLK), .data_out(inst521_data_out));  // open: ld, cl, inc, dec, data_in
  REGX #(.size(10), .default_value(500)) inst518 (
    .clk(CLK), .data_out(inst518_data_out));  // open: ld, cl, inc, dec, data_in
  CMPX #(.size(10)) inst517 (.A(bstrana), .B(inst518_data_out), .eq(inst517_eq));  // open: ls, gr
  MP2X #(.size(4)) inst497 (.S(svetloo), .X0(inst494_y), .X1(ZA), .Y(R));
  MP2X #(.size(4)) inst498 (.S(svetloo), .X0(inst495_y), .X1(ZB), .Y(G));
  MP2X #(.size(4)) inst499 (.S(svetloo), .X0(inst496_y), .X1(ZC), .Y(B));
  MP2X #(.size(4)) inst83 (.S(desnaantena), .X0(inst80_y), .X1(SA), .Y(inst83_y));
  MP2X #(.size(4)) inst84 (.S(desnaantena), .X0(inst81_y), .X1(SB), .Y(inst84_y));
  MP2X #(.size(4)) inst85 (.S(desnaantena), .X0(inst82_y), .X1(SC), .Y(inst85_y));
  CMPX #(.size(10)) inst513 (.A(dstrana), .B(inst521_data_out), .gr(inst513_gr));  // open: ls, eq
  and inst523 (\2berror , inst515_out, inst517_eq);
  REGX #(.size(10), .default_value(55)) inst1 (
    .clk(CLK), .inc(inst161_out), .dec(inst160_out), .data_out(dstrana));  // open: ld, cl, data_in
  CMPX #(.size(10)) inst5 (.A(X), .B(dstrana), .ls(inst5_ls));  // open: eq, gr
  REGX #(.size(10), .default_value(55)) inst2 (
    .clk(CLK), .inc(inst239_out), .dec(inst204_out), .data_out(bstrana));  // open: ld, cl, data_in
  CMPX #(.size(10)) inst8 (.A(Y), .B(bstrana), .ls(inst8_ls));  // open: eq, gr
  DFF inst199 (.CLK(CLK), .D(inst198_out_clk), .Q(inst199_q));  // open: CLRN, PRN
  DFF inst13 (.CLK(CLK), .D(inst12_out_clk), .Q(inst13_q));  // open: CLRN, PRN
  MP2X #(.size(4)) inst86 (.S(usta), .X0(inst83_y), .X1(CRNAA), .Y(inst86_y));
  MP2X #(.size(4)) inst87 (.S(usta), .X0(inst84_y), .X1(CRNAB), .Y(inst87_y));
  MP2X #(.size(4)) inst88 (.S(usta), .X0(inst85_y), .X1(CRNAC), .Y(inst88_y));
  and inst9 (yok, inst8_ls, inst118_gr);
  REGX #(.size(10), .default_value(721)) inst543 (
    .clk(CLK), .data_out(inst543_data_out));  // open: ld, cl, inc, dec, data_in
  CMPX #(.size(10)) inst534 (.A(dstrana), .B(inst543_data_out), .ls(inst534_ls));  // open: eq, gr
  REGX #(.size(10), .default_value(220)) inst541 (
    .clk(CLK), .data_out(inst541_data_out));  // open: ld, cl, inc, dec, data_in
  CMPX #(.size(10)) inst536 (.A(tstrana), .B(inst541_data_out), .eq(inst536_eq));  // open: ls, gr
  DFF inst200 (.CLK(CLK), .D(inst199_q), .Q(inst200_q));  // open: CLRN, PRN
  DFF inst14 (.CLK(CLK), .D(inst13_q), .Q(inst14_q));  // open: CLRN, PRN
  and inst6 (xok, inst5_ls, inst4_gr);
  and inst239 (inst239_out, gravitacija, nberror);
  and inst204 (inst204_out, letenje, w);
  and inst161 (inst161_out, gravitacija, d);
  and inst160 (inst160_out, gravitacija, a);
  REGX #(.size(10), .default_value(134)) inst520 (
    .clk(CLK), .data_out(inst520_data_out));  // open: ld, cl, inc, dec, data_in
  REGX #(.size(10), .default_value(520)) inst519 (
    .clk(CLK), .data_out(inst519_data_out));  // open: ld, cl, inc, dec, data_in
  CMPX #(.size(10)) inst516 (.A(tstrana), .B(inst519_data_out), .eq(inst516_eq));  // open: ls, gr
  and inst538 (\4terror , inst535_out, inst536_eq);
  CONSTX #(.size(4), .\const (13)) inst489 (.data(ZA));
  CONSTX #(.size(4), .\const (15)) inst493 (.data(ZB));
  CONSTX #(.size(4), .\const (5)) inst488 (.data(ZC));
  not inst201 (inst201_out, inst200_q);
  not inst15 (inst15_out, inst14_q);
  and inst10 (telo, xok, yok);
  CMPX #(.size(10)) inst514 (.A(dstrana), .B(inst520_data_out), .ls(inst514_ls));  // open: eq, gr
  and inst535 (inst535_out, inst534_ls, inst533_gr);
  MP2X #(.size(4)) inst139 (.S(levarukamirna), .X0(inst86_y), .X1(SSA), .Y(inst139_y));
  MP2X #(.size(4)) inst140 (.S(levarukamirna), .X0(inst87_y), .X1(SSB), .Y(inst140_y));
  MP2X #(.size(4)) inst141 (.S(levarukamirna), .X0(inst88_y), .X1(SSC), .Y(inst141_y));
  and inst202 (letenje, inst199_q, inst201_out);
  and inst16 (gravitacija, inst13_q, inst15_out);
  and inst515 (inst515_out, inst514_ls, inst513_gr);
  and inst522 (\2terror , inst515_out, inst516_eq);
  or inst158 (valid, telo, levaantena, desnaantena, levarukamirna, levarukapokret, levasakamirna, levasakapokret, desnarukamirna, desnarukapokret, desnasakamirna, desnasakapokret, 1'b0);
  CONSTX #(.size(4), .\const (6)) inst142 (.data(inst142_data));
  CONSTX #(.size(4), .\const (7)) inst143 (.data(inst143_data));
  CONSTX #(.size(4), .\const (15)) inst144 (.data(inst144_data));
  MP2X #(.size(4)) inst148 (.S(desnarukamirna), .X0(inst139_y), .X1(SSA), .Y(inst148_y));
  MP2X #(.size(4)) inst149 (.S(desnarukamirna), .X0(inst140_y), .X1(SSB), .Y(inst149_y));
  MP2X #(.size(4)) inst150 (.S(desnarukamirna), .X0(inst141_y), .X1(SSC), .Y(inst150_y));
  CONSTX #(.size(4), .\const (13)) inst145 (.data(inst145_data));
  CONSTX #(.size(4), .\const (5)) inst146 (.data(inst146_data));
  CONSTX #(.size(4), .\const (0)) inst147 (.data(inst147_data));
  MP2X #(.size(4)) inst566 (.S(kulizgled), .X0(inst142_data), .X1(CRNAA), .Y(SSA));
  MP2X #(.size(4)) inst569 (.S(kulizgled), .X0(inst143_data), .X1(CRNAB), .Y(SSB));
  MP2X #(.size(4)) inst570 (.S(kulizgled), .X0(inst144_data), .X1(CRNAC), .Y(SSC));
  MP2X #(.size(4)) inst151 (.S(levasakamirna), .X0(inst148_y), .X1(NA), .Y(inst151_y));
  MP2X #(.size(4)) inst152 (.S(levasakamirna), .X0(inst149_y), .X1(NB), .Y(inst152_y));
  MP2X #(.size(4)) inst153 (.S(levasakamirna), .X0(inst150_y), .X1(NC), .Y(inst153_y));
  MP2X #(.size(4)) inst571 (.S(kulizgled), .X0(inst145_data), .X1(CRNAA), .Y(NA));
  MP2X #(.size(4)) inst572 (.S(kulizgled), .X0(inst146_data), .X1(CRNAB), .Y(NB));
  MP2X #(.size(4)) inst573 (.S(kulizgled), .X0(inst147_data), .X1(CRNAC), .Y(NC));
  MP2X #(.size(4)) inst154 (.S(desnasakamirna), .X0(inst151_y), .X1(NA), .Y(DALJEA));
  MP2X #(.size(4)) inst155 (.S(desnasakamirna), .X0(inst152_y), .X1(NB), .Y(DALJEB));
  MP2X #(.size(4)) inst156 (.S(desnasakamirna), .X0(inst153_y), .X1(NC), .Y(DALJEC));
  REGX #(.size(10), .default_value(25)) inst22 (
    .clk(CLK), .inc(inst240_out), .dec(inst205_out), .data_out(inst22_data_out));  // open: ld, cl, data_in
  CMPX #(.size(10)) inst119 (.A(Y), .B(inst22_data_out), .gr(inst119_gr));  // open: ls, eq
  REGX #(.size(10), .default_value(25)) inst3 (
    .clk(CLK), .inc(inst163_out), .dec(inst162_out), .data_out(inst3_data_out));  // open: ld, cl, data_in
  CMPX #(.size(10)) inst11 (.A(X), .B(inst3_data_out), .gr(inst11_gr));  // open: ls, eq
  REGX #(.size(10), .default_value(126)) inst558 (
    .clk(CLK), .inc(inst553_out), .dec(inst554_out), .data_out(levaaaa));  // open: ld, cl, data_in
  CMPX #(.size(10)) inst546 (.A(dstrana), .B(levaaaa), .gr(inst546_gr));  // open: ls, eq
  REGX #(.size(10), .default_value(300)) inst560 (
    .clk(CLK), .data_out(inst560_data_out));  // open: ld, cl, inc, dec, data_in
  CMPX #(.size(10)) inst552 (.A(bstrana), .B(inst560_data_out), .eq(inst552_eq));  // open: ls, gr
  not inst555 (nbit, \bit );
  REGX #(.size(1), .default_value(0)) inst544 (
    .clk(gravitacija), .inc(inst563_out), .data_out(\bit ));  // open: ld, cl, dec, data_in
  and inst550 (\5berror , khmkhm, inst552_eq);
  and inst162 (inst162_out, gravitacija, a);
  and inst240 (inst240_out, gravitacija, nberror);
  and inst205 (inst205_out, letenje, w);
  and inst163 (inst163_out, gravitacija, d);
  and inst553 (inst553_out, nbit, gravitacija);
  and inst554 (inst554_out, gravitacija, \bit );
  or inst563 (inst563_out, inst562_eq, inst545_eq);
  REGX #(.size(10), .default_value(35)) inst27 (
    .clk(CLK), .inc(inst241_out), .dec(inst206_out), .data_out(inst27_data_out));  // open: ld, cl, data_in
  CMPX #(.size(10)) inst23 (.A(Y), .B(inst27_data_out), .ls(inst23_ls));  // open: eq, gr
  REGX #(.size(10), .default_value(35)) inst26 (
    .clk(CLK), .inc(inst165_out), .dec(inst164_out), .data_out(inst26_data_out));  // open: ld, cl, data_in
  CMPX #(.size(10)) inst17 (.A(X), .B(inst26_data_out), .ls(inst17_ls));  // open: eq, gr
  REGX #(.size(10), .default_value(284)) inst559 (
    .clk(CLK), .inc(inst556_out), .dec(inst557_out), .data_out(desnaaaa));  // open: ld, cl, data_in
  CMPX #(.size(10)) inst547 (.A(dstrana), .B(desnaaaa), .ls(inst547_ls));  // open: eq, gr
  REGX #(.size(10), .default_value(320)) inst561 (
    .clk(CLK), .data_out(inst561_data_out));  // open: ld, cl, inc, dec, data_in
  CMPX #(.size(10)) inst549 (.A(tstrana), .B(inst561_data_out), .eq(inst549_eq));  // open: ls, gr
  CMPX #(.size(10)) inst545 (.A(levaaaa), .B(inst564_data), .eq(inst545_eq));  // open: ls, gr
  and inst21 (inst21_out, inst17_ls, inst11_gr);
  and inst24 (inst24_out, inst23_ls, inst119_gr);
  and inst551 (\5terror , inst549_eq, khmkhm);
  CONSTX #(.size(10), .\const (1)) inst564 (.data(inst564_data));
  and inst164 (inst164_out, gravitacija, a);
  and inst241 (inst241_out, gravitacija, nberror);
  and inst206 (inst206_out, letenje, w);
  and inst165 (inst165_out, gravitacija, d);
  and inst548 (khmkhm, inst547_ls, inst546_gr);
  CMPX #(.size(10)) inst562 (.A(desnaaaa), .B(inst565_data), .eq(inst562_eq));  // open: ls, gr
  and inst25 (levooko, inst21_out, inst24_out);
  and inst556 (inst556_out, nbit, gravitacija);
  and inst557 (inst557_out, gravitacija, \bit );
  CONSTX #(.size(10), .\const (834)) inst565 (.data(inst565_data));
  REGX #(.size(10), .default_value(47)) inst107 (
    .clk(CLK), .inc(inst253_out), .dec(inst218_out), .data_out(inst107_data_out));  // open: ld, cl, data_in
  REGX #(.size(10), .default_value(37)) inst373 (
    .clk(CLK), .inc(inst371_out), .dec(inst369_out), .data_out(tmetak));  // open: ld, cl, data_in
  REGX #(.size(10), .default_value(9)) inst136 (
    .clk(CLK), .inc(inst191_out), .dec(inst190_out), .data_out(inst136_data_out));  // open: ld, cl, data_in
  CMPX #(.size(10)) inst128 (.A(X), .B(inst136_data_out), .gr(inst128_gr));  // open: ls, eq
  REGX #(.size(10), .default_value(47)) inst137 (
    .clk(CLK), .inc(inst254_out), .dec(inst219_out), .data_out(inst137_data_out));  // open: ld, cl, data_in
  CMPX #(.size(10)) inst134 (.A(Y), .B(inst137_data_out), .gr(inst134_gr));  // open: ls, eq
  REGX #(.size(10), .default_value(55)) inst105 (
    .clk(CLK), .inc(inst189_out), .dec(inst188_out), .data_out(inst105_data_out));  // open: ld, cl, data_in
  CMPX #(.size(10)) inst99 (.A(X), .B(inst105_data_out), .gr(inst99_gr));  // open: ls, eq
  CMPX #(.size(10)) inst125 (.A(Y), .B(inst107_data_out), .gr(inst125_gr));  // open: ls, eq
  REGX #(.size(10), .default_value(40)) inst35 (
    .clk(CLK), .inc(inst167_out), .dec(inst166_out), .data_out(inst35_data_out));  // open: ld, cl, data_in
  CMPX #(.size(10)) inst28 (.A(X), .B(inst35_data_out), .gr(inst28_gr));  // open: ls, eq
  REGX #(.size(10), .default_value(25)) inst31 (
    .clk(CLK), .inc(inst242_out), .dec(inst207_out), .data_out(inst31_data_out));  // open: ld, cl, data_in
  CMPX #(.size(10)) inst120 (.A(Y), .B(inst31_data_out), .gr(inst120_gr));  // open: ls, eq
  REGX #(.size(10), .default_value(76)) inst375 (
    .clk(CLK), .inc(inst367_out), .dec(inst366_out), .data_out(lmetak));  // open: ld, cl, data_in
  CMPX #(.size(10)) inst357 (.A(X), .B(lmetak), .gr(inst357_gr));  // open: ls, eq
  CMPX #(.size(10)) inst363 (.A(Y), .B(tmetak), .gr(inst363_gr));  // open: ls, eq
  and inst253 (inst253_out, gravitacija, nberror);
  and inst218 (inst218_out, letenje, w);
  and inst242 (inst242_out, gravitacija, nberror);
  and inst207 (inst207_out, letenje, w);
  and inst371 (inst371_out, gravitacija, nberror);
  and inst369 (inst369_out, letenje, w);
  and inst191 (inst191_out, gravitacija, d);
  and inst190 (inst190_out, gravitacija, a);
  and inst254 (inst254_out, gravitacija, nberror);
  and inst219 (inst219_out, letenje, w);
  and inst189 (inst189_out, gravitacija, d);
  and inst188 (inst188_out, gravitacija, a);
  and inst167 (inst167_out, gravitacija, d);
  and inst166 (inst166_out, gravitacija, a);
  and inst367 (inst367_out, gravitacija, d);
  and inst366 (inst366_out, gravitacija, a);
  REGX #(.size(10), .default_value(52)) inst108 (
    .clk(CLK), .inc(inst252_out), .dec(inst217_out), .data_out(inst108_data_out));  // open: ld, cl, data_in
  REGX #(.size(10), .default_value(40)) inst374 (
    .clk(CLK), .inc(inst370_out), .dec(inst368_out), .data_out(bmetak));  // open: ld, cl, data_in
  REGX #(.size(10), .default_value(20)) inst135 (
    .clk(CLK), .inc(inst193_out), .dec(inst192_out), .data_out(inst135_data_out));  // open: ld, cl, data_in
  CMPX #(.size(10)) inst129 (.A(X), .B(inst135_data_out), .ls(inst129_ls));  // open: eq, gr
  REGX #(.size(10), .default_value(52)) inst138 (
    .clk(CLK), .inc(inst255_out), .dec(inst220_out), .data_out(inst138_data_out));  // open: ld, cl, data_in
  CMPX #(.size(10)) inst131 (.A(Y), .B(inst138_data_out), .ls(inst131_ls));  // open: eq, gr
  REGX #(.size(10), .default_value(66)) inst106 (
    .clk(CLK), .inc(inst187_out), .dec(inst186_out), .data_out(inst106_data_out));  // open: ld, cl, data_in
  CMPX #(.size(10)) inst100 (.A(X), .B(inst106_data_out), .ls(inst100_ls));  // open: eq, gr
  CMPX #(.size(10)) inst102 (.A(Y), .B(inst108_data_out), .ls(inst102_ls));  // open: eq, gr
  REGX #(.size(10), .default_value(50)) inst36 (
    .clk(CLK), .inc(inst169_out), .dec(inst168_out), .data_out(inst36_data_out));  // open: ld, cl, data_in
  CMPX #(.size(10)) inst29 (.A(X), .B(inst36_data_out), .ls(inst29_ls));  // open: eq, gr
  REGX #(.size(10), .default_value(35)) inst37 (
    .clk(CLK), .inc(inst243_out), .dec(inst208_out), .data_out(inst37_data_out));  // open: ld, cl, data_in
  CMPX #(.size(10)) inst32 (.A(Y), .B(inst37_data_out), .ls(inst32_ls));  // open: eq, gr
  REGX #(.size(10), .default_value(80)) inst376 (
    .clk(CLK), .inc(inst365_out), .dec(inst364_out), .data_out(dmetak));  // open: ld, cl, data_in
  CMPX #(.size(10)) inst358 (.A(X), .B(dmetak), .ls(inst358_ls));  // open: eq, gr
  CMPX #(.size(10)) inst360 (.A(Y), .B(bmetak), .ls(inst360_ls));  // open: eq, gr
  and inst103 (inst103_out, inst102_ls, inst125_gr);
  and inst361 (inst361_out, inst360_ls, inst363_gr);
  and inst130 (inst130_out, inst129_ls, inst128_gr);
  and inst132 (inst132_out, inst131_ls, inst134_gr);
  and inst101 (inst101_out, inst100_ls, inst99_gr);
  and inst252 (inst252_out, gravitacija, nberror);
  and inst217 (inst217_out, letenje, w);
  and inst30 (inst30_out, inst29_ls, inst28_gr);
  and inst243 (inst243_out, gravitacija, nberror);
  and inst208 (inst208_out, letenje, w);
  and inst33 (inst33_out, inst32_ls, inst120_gr);
  and inst359 (inst359_out, inst358_ls, inst357_gr);
  and inst370 (inst370_out, gravitacija, nberror);
  and inst368 (inst368_out, letenje, w);
  and inst193 (inst193_out, gravitacija, d);
  and inst192 (inst192_out, gravitacija, a);
  and inst255 (inst255_out, gravitacija, nberror);
  and inst220 (inst220_out, letenje, w);
  and inst187 (inst187_out, gravitacija, d);
  and inst186 (inst186_out, gravitacija, a);
  and inst169 (inst169_out, gravitacija, d);
  and inst168 (inst168_out, gravitacija, a);
  and inst365 (inst365_out, gravitacija, d);
  and inst364 (inst364_out, gravitacija, a);
  and inst104 (inst104_out, inst101_out, inst103_out);
  and inst34 (desnooko, inst30_out, inst33_out);
  and inst362 (startna_pozicija_metka, inst359_out, inst361_out);
  and inst133 (inst133_out, inst130_out, inst132_out);
  and inst263 (desnasakamirna, inst104_out, ne);
  and inst260 (levasakamirna, inst133_out, nq);
  REGX #(.size(10), .default_value(58)) inst98 (
    .clk(CLK), .inc(inst185_out), .dec(inst184_out), .data_out(inst98_data_out));  // open: ld, cl, data_in
  REGX #(.size(10), .default_value(35)) inst96 (
    .clk(CLK), .inc(inst251_out), .dec(inst216_out), .data_out(inst96_data_out));  // open: ld, cl, data_in
  CMPX #(.size(10)) inst124 (.A(Y), .B(inst96_data_out), .gr(inst124_gr));  // open: ls, eq
  REGX #(.size(10), .default_value(13)) inst41 (
    .clk(CLK), .inc(inst244_out), .dec(inst209_out), .data_out(inst41_data_out));  // open: ld, cl, data_in
  CMPX #(.size(10)) inst121 (.A(Y), .B(inst41_data_out), .gr(inst121_gr));  // open: ls, eq
  REGX #(.size(10), .default_value(12)) inst115 (
    .clk(CLK), .inc(inst195_out), .dec(inst194_out), .data_out(inst115_data_out));  // open: ld, cl, data_in
  CMPX #(.size(10)) inst109 (.A(X), .B(inst115_data_out), .gr(inst109_gr));  // open: ls, eq
  REGX #(.size(10), .default_value(35)) inst117 (
    .clk(CLK), .inc(inst256_out), .dec(inst221_out), .data_out(inst117_data_out));  // open: ld, cl, data_in
  CMPX #(.size(10)) inst126 (.A(Y), .B(inst117_data_out), .gr(inst126_gr));  // open: ls, eq
  CMPX #(.size(10)) inst89 (.A(X), .B(inst98_data_out), .gr(inst89_gr));  // open: ls, eq
  REGX #(.size(10), .default_value(25)) inst46 (
    .clk(CLK), .inc(inst171_out), .dec(inst170_out), .data_out(inst46_data_out));  // open: ld, cl, data_in
  CMPX #(.size(10)) inst38 (.A(X), .B(inst46_data_out), .gr(inst38_gr));  // open: ls, eq
  REGX #(.size(10), .default_value(37)) inst393 (
    .clk(CLK), .ld(isE), .data_in(tmetak), .data_out(ttmetak));  // open: cl, inc, dec
  CMPX #(.size(10)) inst382 (.A(Y), .B(ttmetak), .gr(inst382_gr));  // open: ls, eq
  REGX #(.size(10), .default_value(76)) inst391 (
    .clk(CLK), .ld(isE), .inc(letenje), .data_in(lmetak), .data_out(llmetak));  // open: cl, dec
  CMPX #(.size(10)) inst372 (.A(X), .B(llmetak), .gr(inst372_gr));  // open: ls, eq
  and inst256 (inst256_out, gravitacija, nberror);
  and inst221 (inst221_out, letenje, w);
  and inst185 (inst185_out, gravitacija, d);
  and inst184 (inst184_out, gravitacija, a);
  and inst251 (inst251_out, gravitacija, nberror);
  and inst216 (inst216_out, letenje, w);
  and inst170 (inst170_out, gravitacija, a);
  and inst244 (inst244_out, gravitacija, nberror);
  and inst209 (inst209_out, letenje, w);
  REGX #(.size(10), .default_value(376)) inst395 (
    .clk(CLK), .inc(inst386_out), .dec(inst385_out), .data_out(inst395_data_out));  // open: ld, cl, data_in
  and inst195 (inst195_out, gravitacija, d);
  and inst194 (inst194_out, gravitacija, a);
  and inst171 (inst171_out, gravitacija, d);
  CMPX #(.size(10)) inst384 (.A(inst395_data_out), .B(llmetak), .eq(stop));  // open: ls, gr
  REGX #(.size(10), .default_value(63)) inst95 (
    .clk(CLK), .inc(inst183_out), .dec(inst182_out), .data_out(inst95_data_out));  // open: ld, cl, data_in
  REGX #(.size(10), .default_value(47)) inst97 (
    .clk(CLK), .inc(inst250_out), .dec(inst215_out), .data_out(inst97_data_out));  // open: ld, cl, data_in
  CMPX #(.size(10)) inst92 (.A(Y), .B(inst97_data_out), .ls(inst92_ls));  // open: eq, gr
  REGX #(.size(10), .default_value(20)) inst45 (
    .clk(CLK), .inc(inst245_out), .dec(inst210_out), .data_out(inst45_data_out));  // open: ld, cl, data_in
  CMPX #(.size(10)) inst42 (.A(Y), .B(inst45_data_out), .ls(inst42_ls));  // open: eq, gr
  and inst385 (inst385_out, gravitacija, a);
  not inst387 (nstop, stop);
  REGX #(.size(10), .default_value(17)) inst116 (
    .clk(CLK), .inc(inst197_out), .dec(inst196_out), .data_out(inst116_data_out));  // open: ld, cl, data_in
  CMPX #(.size(10)) inst110 (.A(X), .B(inst116_data_out), .ls(inst110_ls));  // open: eq, gr
  REGX #(.size(10), .default_value(47)) inst127 (
    .clk(CLK), .inc(inst257_out), .dec(inst222_out), .data_out(inst127_data_out));  // open: ld, cl, data_in
  CMPX #(.size(10)) inst112 (.A(Y), .B(inst127_data_out), .ls(inst112_ls));  // open: eq, gr
  CMPX #(.size(10)) inst90 (.A(X), .B(inst95_data_out), .ls(inst90_ls));  // open: eq, gr
  REGX #(.size(10), .default_value(27)) inst47 (
    .clk(CLK), .inc(inst173_out), .dec(inst172_out), .data_out(inst47_data_out));  // open: ld, cl, data_in
  CMPX #(.size(10)) inst39 (.A(X), .B(inst47_data_out), .ls(inst39_ls));  // open: eq, gr
  and inst386 (inst386_out, gravitacija, d);
  REGX #(.size(10), .default_value(40)) inst394 (
    .clk(CLK), .ld(isE), .data_in(bmetak), .data_out(bbmetak));  // open: cl, inc, dec
  CMPX #(.size(10)) inst379 (.A(Y), .B(bbmetak), .ls(inst379_ls));  // open: eq, gr
  REGX #(.size(10), .default_value(80)) inst392 (
    .clk(CLK), .ld(isE), .inc(letenje), .data_in(dmetak), .data_out(ddmetak));  // open: cl, dec
  CMPX #(.size(10)) inst377 (.A(X), .B(ddmetak), .ls(inst377_ls));  // open: eq, gr
  and inst91 (inst91_out, inst90_ls, inst89_gr);
  and inst93 (inst93_out, inst92_ls, inst124_gr);
  and inst40 (inst40_out, inst39_ls, inst38_gr);
  and inst43 (inst43_out, inst42_ls, inst121_gr);
  and inst111 (inst111_out, inst110_ls, inst109_gr);
  and inst257 (inst257_out, gravitacija, nberror);
  and inst222 (inst222_out, letenje, w);
  and inst113 (inst113_out, inst112_ls, inst126_gr);
  and inst183 (inst183_out, gravitacija, d);
  and inst182 (inst182_out, gravitacija, a);
  and inst250 (inst250_out, gravitacija, nberror);
  and inst215 (inst215_out, letenje, w);
  and inst172 (inst172_out, gravitacija, a);
  and inst245 (inst245_out, gravitacija, nberror);
  and inst210 (inst210_out, letenje, w);
  and inst378 (inst378_out, inst377_ls, inst372_gr);
  and inst380 (inst380_out, inst379_ls, inst382_gr);
  and inst197 (inst197_out, gravitacija, d);
  and inst196 (inst196_out, gravitacija, a);
  and inst173 (inst173_out, gravitacija, d);
  and inst114 (inst114_out, inst111_out, inst113_out);
  and inst94 (inst94_out, inst91_out, inst93_out);
  and inst44 (levaantena, inst40_out, inst43_out);
  and inst381 (inst381_out, inst378_out, inst380_out);
  and inst261 (levarukamirna, inst114_out, nq);
  and inst262 (desnarukamirna, inst94_out, ne);
  and inst383 (metak, inst381_out, isE);
  REGX #(.size(10), .default_value(13)) inst56 (
    .clk(CLK), .inc(inst246_out), .dec(inst211_out), .data_out(inst56_data_out));  // open: ld, cl, data_in
  CMPX #(.size(10)) inst122 (.A(Y), .B(inst56_data_out), .gr(inst122_gr));  // open: ls, eq
  REGX #(.size(10), .default_value(25)) inst67 (
    .clk(CLK), .inc(inst181_out), .dec(inst180_out), .data_out(inst67_data_out));  // open: ld, cl, data_in
  CMPX #(.size(10)) inst58 (.A(X), .B(inst67_data_out), .gr(inst58_gr));  // open: ls, eq
  REGX #(.size(10), .default_value(40)) inst64 (
    .clk(CLK), .inc(inst249_out), .dec(inst214_out), .data_out(inst64_data_out));  // open: ld, cl, data_in
  CMPX #(.size(10)) inst123 (.A(Y), .B(inst64_data_out), .gr(inst123_gr));  // open: ls, eq
  REGX #(.size(10), .default_value(48)) inst54 (
    .clk(CLK), .inc(inst175_out), .dec(inst174_out), .data_out(inst54_data_out));  // open: ld, cl, data_in
  CMPX #(.size(10)) inst48 (.A(X), .B(inst54_data_out), .gr(inst48_gr));  // open: ls, eq
  REGX #(.size(10), .default_value(0)) inst305 (
    .clk(CLK), .inc(inst317_out), .dec(inst316_out), .data_out(inst305_data_out));  // open: ld, cl, data_in
  CMPX #(.size(10)) inst295 (.A(X), .B(inst305_data_out), .gr(inst295_gr));  // open: ls, eq
  REGX #(.size(10), .default_value(32)) inst302 (
    .clk(CLK), .inc(inst336_out), .dec(inst328_out), .data_out(inst302_data_out));  // open: ld, cl, data_in
  CMPX #(.size(10)) inst301 (.A(Y), .B(inst302_data_out), .gr(inst301_gr));  // open: ls, eq
  REGX #(.size(10), .default_value(72)) inst283 (
    .clk(CLK), .inc(inst315_out), .dec(inst314_out), .data_out(inst283_data_out));  // open: ld, cl, data_in
  CMPX #(.size(10)) inst275 (.A(X), .B(inst283_data_out), .gr(inst275_gr));  // open: ls, eq
  REGX #(.size(10), .default_value(32)) inst284 (
    .clk(CLK), .inc(inst335_out), .dec(inst327_out), .data_out(inst284_data_out));  // open: ld, cl, data_in
  CMPX #(.size(10)) inst281 (.A(Y), .B(inst284_data_out), .gr(inst281_gr));  // open: ls, eq
  and inst174 (inst174_out, gravitacija, a);
  and inst246 (inst246_out, gravitacija, nberror);
  and inst211 (inst211_out, letenje, w);
  and inst181 (inst181_out, gravitacija, d);
  and inst180 (inst180_out, gravitacija, a);
  and inst249 (inst249_out, gravitacija, nberror);
  and inst214 (inst214_out, letenje, w);
  and inst175 (inst175_out, gravitacija, d);
  and inst335 (inst335_out, gravitacija, nberror);
  and inst327 (inst327_out, letenje, w);
  and inst317 (inst317_out, gravitacija, d);
  and inst316 (inst316_out, gravitacija, a);
  and inst336 (inst336_out, gravitacija, nberror);
  and inst328 (inst328_out, letenje, w);
  and inst315 (inst315_out, gravitacija, d);
  and inst314 (inst314_out, gravitacija, a);
  REGX #(.size(10), .default_value(20)) inst57 (
    .clk(CLK), .inc(inst247_out), .dec(inst212_out), .data_out(inst57_data_out));  // open: ld, cl, data_in
  CMPX #(.size(10)) inst51 (.A(Y), .B(inst57_data_out), .ls(inst51_ls));  // open: eq, gr
  REGX #(.size(10), .default_value(50)) inst66 (
    .clk(CLK), .inc(inst179_out), .dec(inst178_out), .data_out(inst66_data_out));  // open: ld, cl, data_in
  CMPX #(.size(10)) inst59 (.A(X), .B(inst66_data_out), .ls(inst59_ls));  // open: eq, gr
  REGX #(.size(10), .default_value(50)) inst65 (
    .clk(CLK), .inc(inst248_out), .dec(inst213_out), .data_out(inst65_data_out));  // open: ld, cl, data_in
  CMPX #(.size(10)) inst61 (.A(Y), .B(inst65_data_out), .ls(inst61_ls));  // open: eq, gr
  REGX #(.size(10), .default_value(50)) inst55 (
    .clk(CLK), .inc(inst177_out), .dec(inst176_out), .data_out(inst55_data_out));  // open: ld, cl, data_in
  CMPX #(.size(10)) inst49 (.A(X), .B(inst55_data_out), .ls(inst49_ls));  // open: eq, gr
  REGX #(.size(10), .default_value(3)) inst304 (
    .clk(CLK), .inc(inst319_out), .dec(inst318_out), .data_out(inst304_data_out));  // open: ld, cl, data_in
  CMPX #(.size(10)) inst296 (.A(X), .B(inst304_data_out), .ls(inst296_ls));  // open: eq, gr
  REGX #(.size(10), .default_value(43)) inst303 (
    .clk(CLK), .inc(inst337_out), .dec(inst329_out), .data_out(inst303_data_out));  // open: ld, cl, data_in
  CMPX #(.size(10)) inst298 (.A(Y), .B(inst303_data_out), .ls(inst298_ls));  // open: eq, gr
  REGX #(.size(10), .default_value(75)) inst282 (
    .clk(CLK), .inc(inst313_out), .dec(inst312_out), .data_out(inst282_data_out));  // open: ld, cl, data_in
  CMPX #(.size(10)) inst276 (.A(X), .B(inst282_data_out), .ls(inst276_ls));  // open: eq, gr
  REGX #(.size(10), .default_value(43)) inst285 (
    .clk(CLK), .inc(inst334_out), .dec(inst326_out), .data_out(inst285_data_out));  // open: ld, cl, data_in
  CMPX #(.size(10)) inst278 (.A(Y), .B(inst285_data_out), .ls(inst278_ls));  // open: eq, gr
  and inst50 (inst50_out, inst49_ls, inst48_gr);
  and inst52 (inst52_out, inst51_ls, inst122_gr);
  and inst60 (inst60_out, inst59_ls, inst58_gr);
  and inst62 (inst62_out, inst61_ls, inst123_gr);
  and inst176 (inst176_out, gravitacija, a);
  and inst247 (inst247_out, gravitacija, nberror);
  and inst212 (inst212_out, letenje, w);
  and inst279 (inst279_out, inst278_ls, inst281_gr);
  and inst179 (inst179_out, gravitacija, d);
  and inst178 (inst178_out, gravitacija, a);
  and inst248 (inst248_out, gravitacija, nberror);
  and inst213 (inst213_out, letenje, w);
  and inst177 (inst177_out, gravitacija, d);
  and inst297 (inst297_out, inst296_ls, inst295_gr);
  and inst299 (inst299_out, inst298_ls, inst301_gr);
  and inst277 (inst277_out, inst276_ls, inst275_gr);
  and inst334 (inst334_out, gravitacija, nberror);
  and inst326 (inst326_out, letenje, w);
  and inst53 (desnaantena, inst50_out, inst52_out);
  and inst319 (inst319_out, gravitacija, d);
  and inst318 (inst318_out, gravitacija, a);
  and inst337 (inst337_out, gravitacija, nberror);
  and inst329 (inst329_out, letenje, w);
  and inst313 (inst313_out, gravitacija, d);
  and inst312 (inst312_out, gravitacija, a);
  and inst63 (usta, inst60_out, inst62_out);
  and inst280 (inst280_out, inst277_out, inst279_out);
  and inst300 (inst300_out, inst297_out, inst299_out);
  and inst343 (desnasakapokret, inst280_out, isE);
  and inst340 (levasakapokret, inst300_out, isQ);
  REGX #(.size(10), .default_value(35)) inst273 (
    .clk(CLK), .inc(inst333_out), .dec(inst325_out), .data_out(inst273_data_out));  // open: ld, cl, data_in
  CMPX #(.size(10)) inst270 (.A(Y), .B(inst273_data_out), .gr(inst270_gr));  // open: ls, eq
  REGX #(.size(10), .default_value(25)) inst402 (
    .clk(CLK), .inc(inst407_out), .dec(inst406_out), .data_out(inst402_data_out));  // open: ld, cl, data_in
  CMPX #(.size(10)) inst388 (.A(X), .B(inst402_data_out), .gr(inst388_gr));  // open: ls, eq
  REGX #(.size(10), .default_value(40)) inst400 (
    .clk(CLK), .inc(inst411_out), .dec(inst409_out), .data_out(inst400_data_out));  // open: ld, cl, data_in
  CMPX #(.size(10)) inst403 (.A(Y), .B(inst400_data_out), .gr(inst403_gr));  // open: ls, eq
  REGX #(.size(10), .default_value(30)) inst421 (
    .clk(CLK), .inc(inst426_out), .dec(inst425_out), .data_out(inst421_data_out));  // open: ld, cl, data_in
  CMPX #(.size(10)) inst412 (.A(X), .B(inst421_data_out), .gr(inst412_gr));  // open: ls, eq
  REGX #(.size(10), .default_value(40)) inst419 (
    .clk(CLK), .inc(inst430_out), .dec(inst428_out), .data_out(inst419_data_out));  // open: ld, cl, data_in
  CMPX #(.size(10)) inst422 (.A(Y), .B(inst419_data_out), .gr(inst422_gr));  // open: ls, eq
  REGX #(.size(10), .default_value(3)) inst307 (
    .clk(CLK), .inc(inst321_out), .dec(inst320_out), .data_out(inst307_data_out));  // open: ld, cl, data_in
  CMPX #(.size(10)) inst286 (.A(X), .B(inst307_data_out), .gr(inst286_gr));  // open: ls, eq
  REGX #(.size(10), .default_value(35)) inst293 (
    .clk(CLK), .inc(inst338_out), .dec(inst330_out), .data_out(inst293_data_out));  // open: ld, cl, data_in
  CMPX #(.size(10)) inst292 (.A(Y), .B(inst293_data_out), .gr(inst292_gr));  // open: ls, eq
  REGX #(.size(10), .default_value(60)) inst271 (
    .clk(CLK), .inc(inst311_out), .dec(inst310_out), .data_out(inst271_data_out));  // open: ld, cl, data_in
  CMPX #(.size(10)) inst264 (.A(X), .B(inst271_data_out), .gr(inst264_gr));  // open: ls, eq
  and inst411 (inst411_out, gravitacija, nberror);
  and inst409 (inst409_out, letenje, w);
  and inst338 (inst338_out, gravitacija, nberror);
  and inst310 (inst310_out, gravitacija, a);
  and inst333 (inst333_out, gravitacija, nberror);
  and inst325 (inst325_out, letenje, w);
  and inst407 (inst407_out, gravitacija, d);
  and inst406 (inst406_out, gravitacija, a);
  and inst426 (inst426_out, gravitacija, d);
  and inst425 (inst425_out, gravitacija, a);
  and inst430 (inst430_out, gravitacija, nberror);
  and inst428 (inst428_out, letenje, w);
  and inst321 (inst321_out, gravitacija, d);
  and inst320 (inst320_out, gravitacija, a);
  and inst330 (inst330_out, letenje, w);
  and inst311 (inst311_out, gravitacija, d);
  REGX #(.size(10), .default_value(40)) inst274 (
    .clk(CLK), .inc(inst332_out), .dec(inst324_out), .data_out(inst274_data_out));  // open: ld, cl, data_in
  CMPX #(.size(10)) inst267 (.A(Y), .B(inst274_data_out), .ls(inst267_ls));  // open: eq, gr
  REGX #(.size(10), .default_value(30)) inst399 (
    .clk(CLK), .inc(inst405_out), .dec(inst404_out), .data_out(inst399_data_out));  // open: ld, cl, data_in
  CMPX #(.size(10)) inst389 (.A(X), .B(inst399_data_out), .ls(inst389_ls));  // open: eq, gr
  REGX #(.size(10), .default_value(50)) inst401 (
    .clk(CLK), .inc(inst410_out), .dec(inst408_out), .data_out(inst401_data_out));  // open: ld, cl, data_in
  CMPX #(.size(10)) inst396 (.A(Y), .B(inst401_data_out), .ls(inst396_ls));  // open: eq, gr
  REGX #(.size(10), .default_value(35)) inst418 (
    .clk(CLK), .inc(inst424_out), .dec(inst423_out), .data_out(inst418_data_out));  // open: ld, cl, data_in
  CMPX #(.size(10)) inst413 (.A(X), .B(inst418_data_out), .ls(inst413_ls));  // open: eq, gr
  REGX #(.size(10), .default_value(50)) inst420 (
    .clk(CLK), .inc(inst429_out), .dec(inst427_out), .data_out(inst420_data_out));  // open: ld, cl, data_in
  CMPX #(.size(10)) inst415 (.A(Y), .B(inst420_data_out), .ls(inst415_ls));  // open: eq, gr
  REGX #(.size(10), .default_value(15)) inst306 (
    .clk(CLK), .inc(inst323_out), .dec(inst322_out), .data_out(inst306_data_out));  // open: ld, cl, data_in
  CMPX #(.size(10)) inst287 (.A(X), .B(inst306_data_out), .ls(inst287_ls));  // open: eq, gr
  REGX #(.size(10), .default_value(40)) inst294 (
    .clk(CLK), .inc(inst339_out), .dec(inst331_out), .data_out(inst294_data_out));  // open: ld, cl, data_in
  CMPX #(.size(10)) inst289 (.A(Y), .B(inst294_data_out), .ls(inst289_ls));  // open: eq, gr
  REGX #(.size(10), .default_value(72)) inst272 (
    .clk(CLK), .inc(inst309_out), .dec(inst308_out), .data_out(inst272_data_out));  // open: ld, cl, data_in
  CMPX #(.size(10)) inst265 (.A(X), .B(inst272_data_out), .ls(inst265_ls));  // open: eq, gr
  and inst266 (inst266_out, inst265_ls, inst264_gr);
  and inst268 (inst268_out, inst267_ls, inst270_gr);
  and inst390 (inst390_out, inst389_ls, inst388_gr);
  and inst410 (inst410_out, gravitacija, nberror);
  and inst408 (inst408_out, letenje, w);
  and inst397 (inst397_out, inst396_ls, inst403_gr);
  and inst414 (inst414_out, inst413_ls, inst412_gr);
  and inst416 (inst416_out, inst415_ls, inst422_gr);
  and inst288 (inst288_out, inst287_ls, inst286_gr);
  and inst339 (inst339_out, gravitacija, nberror);
  and inst331 (inst331_out, letenje, w);
  and inst290 (inst290_out, inst289_ls, inst292_gr);
  and inst308 (inst308_out, gravitacija, a);
  and inst332 (inst332_out, gravitacija, nberror);
  and inst324 (inst324_out, letenje, w);
  and inst405 (inst405_out, gravitacija, d);
  and inst404 (inst404_out, gravitacija, a);
  and inst424 (inst424_out, gravitacija, d);
